# EAGLE design Mainboard (EAGLE 9.5.0)
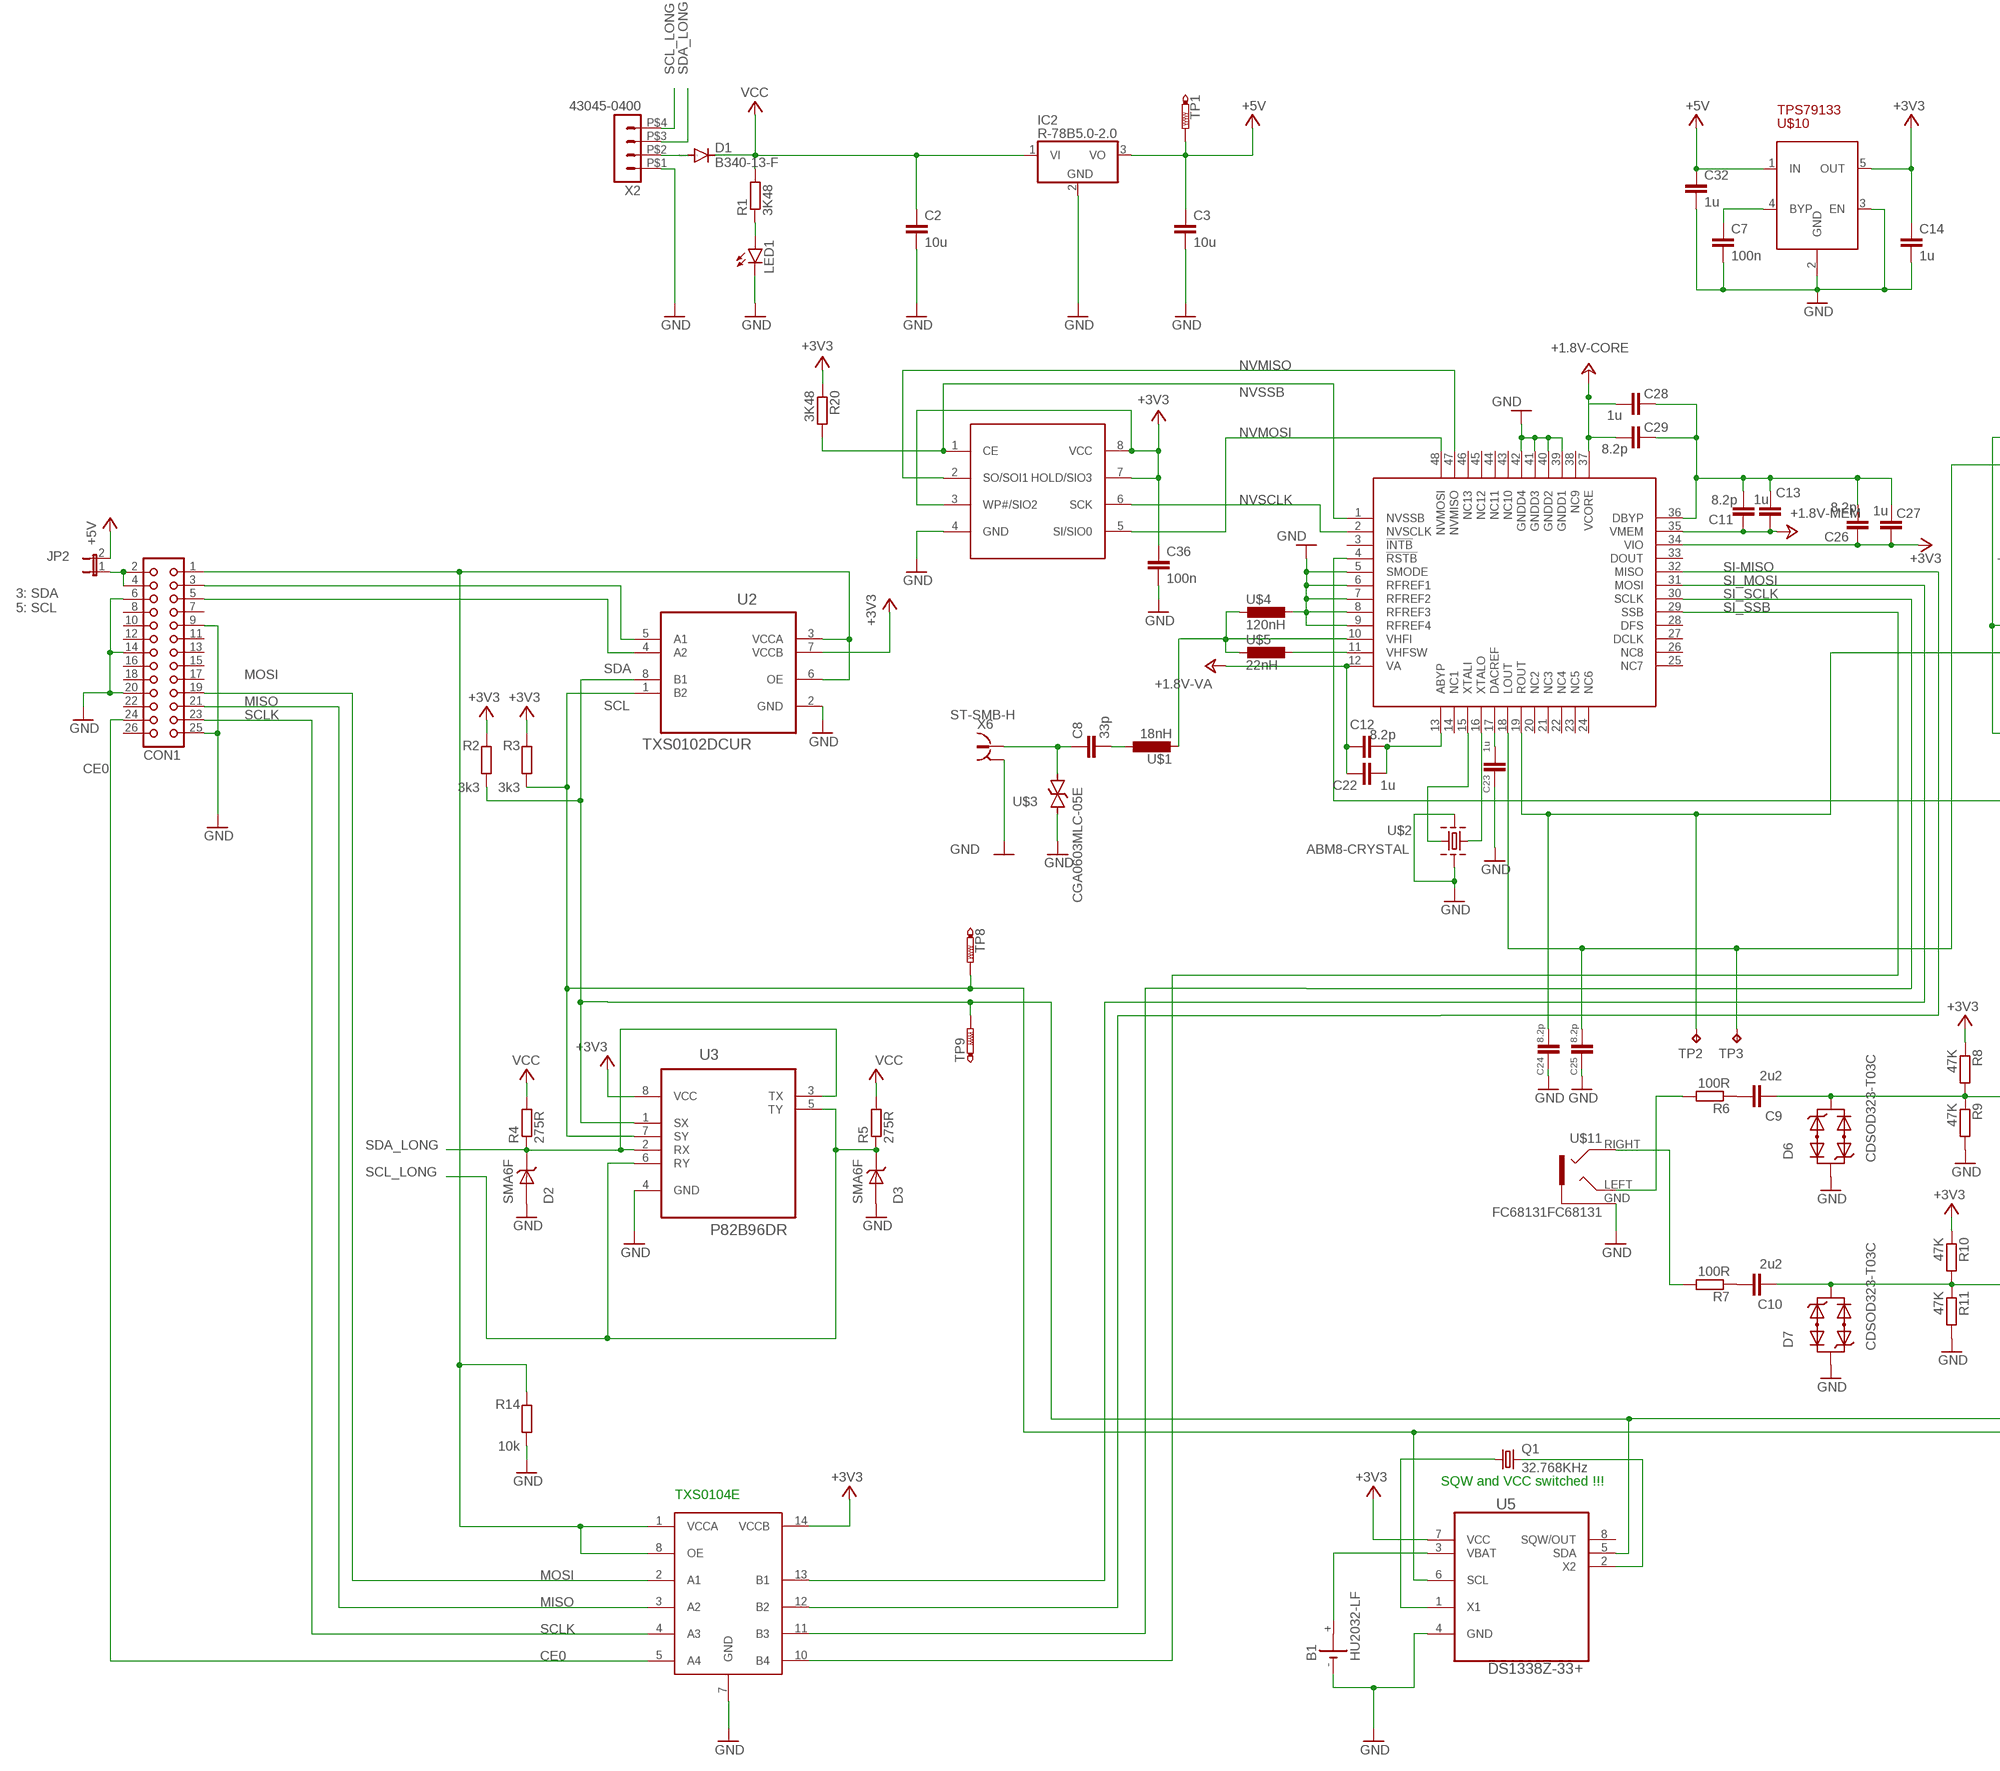
[diagram p0: schematic, sheet 1, part 1 of 3]
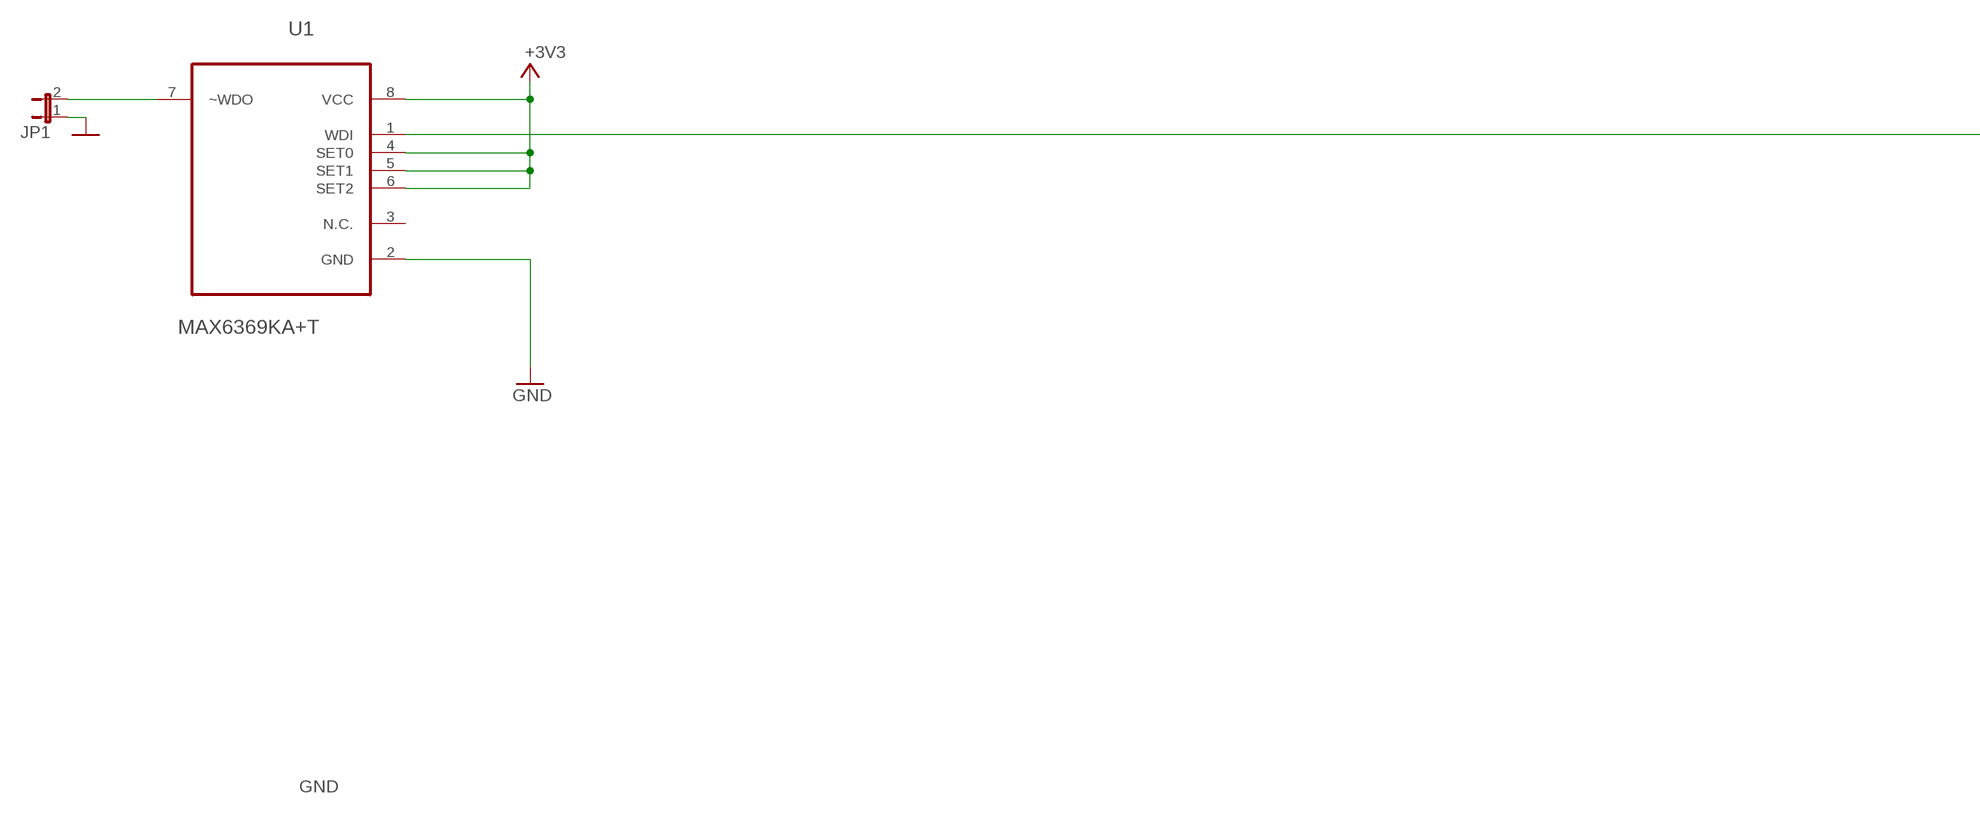
[diagram p1: schematic, sheet 1, part 2 of 3]
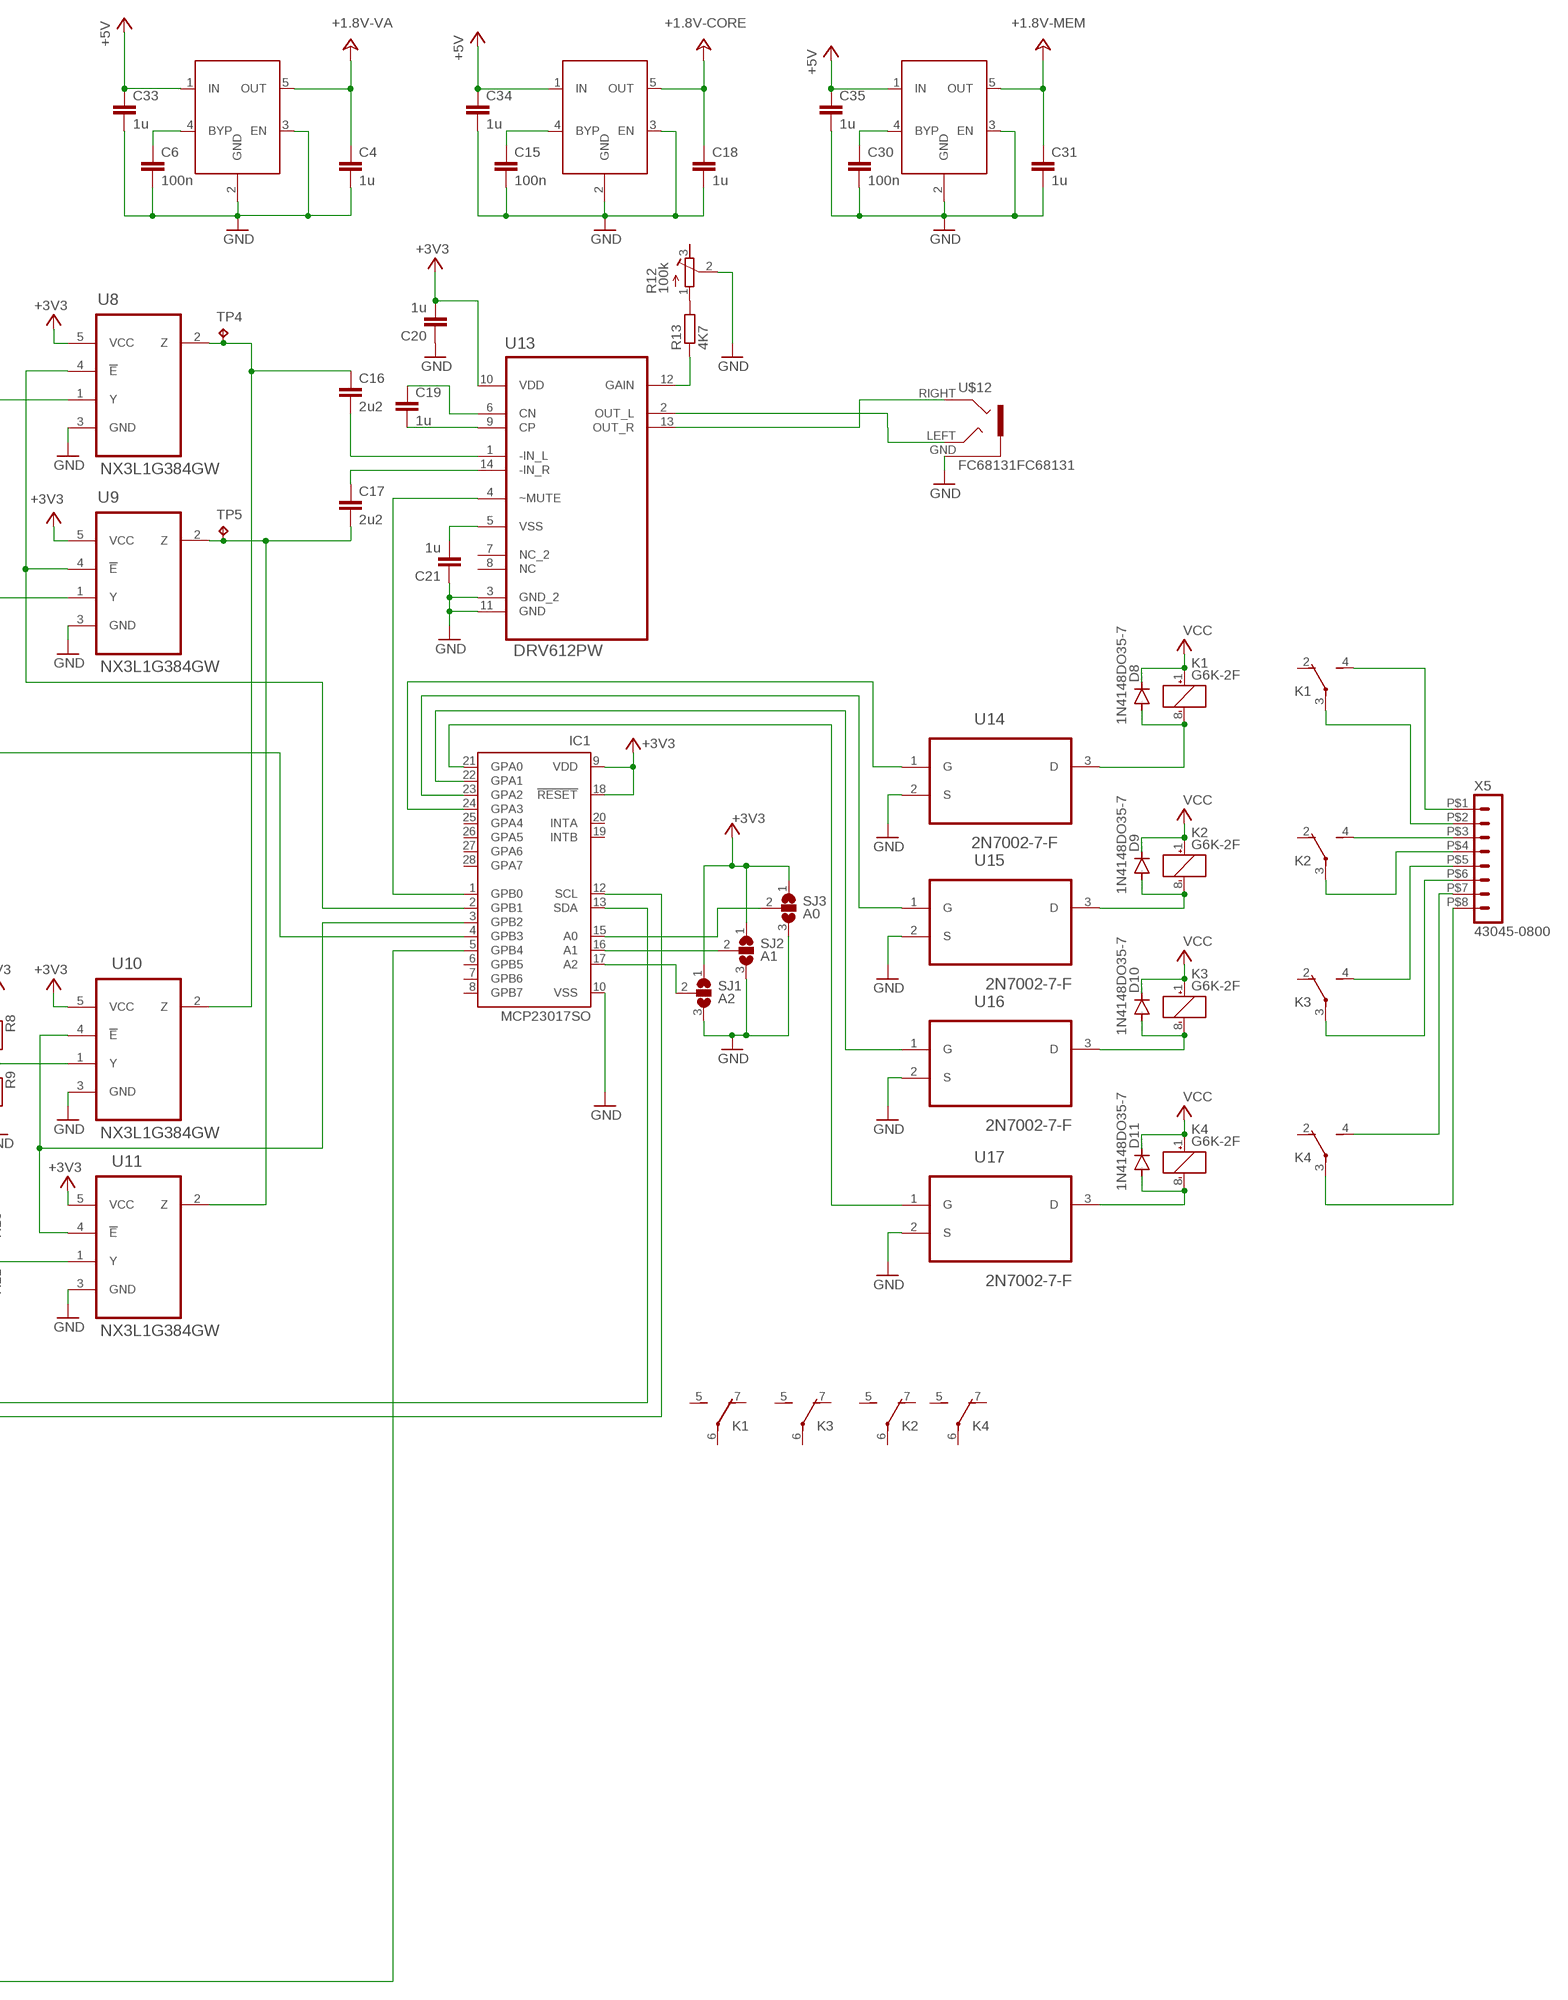
[diagram p2: schematic, sheet 1, part 3 of 3]

## Parts
B1  HU2032-LF  MYCOMPONENTS_HU2032-LF  [MYCOMPONENTS_HU2032-LF]
C2  10u  RCL_C-EUC1206  [RCL_C1206]
C3  10u  RCL_C-EUC1206  [RCL_C1206]
C4  1u  RCL_C-EUC0805  [RCL_C0805]
C6  100n  RCL_C-EUC0805  [RCL_C0805]
C7  100n  RCL_C-EUC0805  [RCL_C0805]
C8  33p  RCL_C-EUC0805  [RCL_C0805]
C9  2u2  RCL_C-EUC0805  [RCL_C0805]
C10  2u2  RCL_C-EUC0805  [RCL_C0805]
C11  8.2p  RCL_C-EUC0805  [RCL_C0805]
C12  8.2p  RCL_C-EUC0805  [RCL_C0805]
C13  1u  RCL_C-EUC0805  [RCL_C0805]
C14  1u  RCL_C-EUC0805  [RCL_C0805]
C15  100n  RCL_C-EUC0805  [RCL_C0805]
C16  2u2  RCL_C-EUC0805  [RCL_C0805]
C17  2u2  RCL_C-EUC0805  [RCL_C0805]
C18  1u  RCL_C-EUC0805  [RCL_C0805]
C19  1u  RCL_C-EUC1005  [RCL_C1005]
C20  1u  RCL_C-EUC1005  [RCL_C1005]
C21  1u  RCL_C-EUC1005  [RCL_C1005]
C22  1u  RCL_C-EUC0805  [RCL_C0805]
C23  1u  RCL_C-EUC0805  [RCL_C0805]
C24  8.2p  RCL_C-EUC0805  [RCL_C0805]
C25  8.2p  RCL_C-EUC0805  [RCL_C0805]
C26  8.2p  RCL_C-EUC0805  [RCL_C0805]
C27  1u  RCL_C-EUC0805  [RCL_C0805]
C28  1u  RCL_C-EUC0805  [RCL_C0805]
C29  8.2p  RCL_C-EUC0805  [RCL_C0805]
C30  100n  RCL_C-EUC0805  [RCL_C0805]
C31  1u  RCL_C-EUC0805  [RCL_C0805]
C32  1u  RCL_C-EUC0805  [RCL_C0805]
C33  1u  RCL_C-EUC0805  [RCL_C0805]
C34  1u  RCL_C-EUC0805  [RCL_C0805]
C35  1u  RCL_C-EUC0805  [RCL_C0805]
C36  100n  RCL_C-EUC0805  [RCL_C0805]
CON1  CON26  [CON26]
D1  B340-13-F  DIODE_DIODE-DO-214AC  [DIODE_DO-214AC]
D2  SMA6F  MYCOMPONENTS_SMA6F  [MYCOMPONENTS_DO-221AC]
D3  SMA6F  MYCOMPONENTS_SMA6F  [MYCOMPONENTS_DO-221AC]
D6  CDSOD323-T03C  MYCOMPONENTS_CDSOD323-T03C  [MYCOMPONENTS_SOD323]
D7  CDSOD323-T03C  MYCOMPONENTS_CDSOD323-T03C  [MYCOMPONENTS_SOD323]
D8  1N4148DO35-7  DIODE_1N4148DO35-7  [DIODE_DO35-7]
D9  1N4148DO35-7  DIODE_1N4148DO35-7  [DIODE_DO35-7]
D10  1N4148DO35-7  DIODE_1N4148DO35-7  [DIODE_DO35-7]
D11  1N4148DO35-7  DIODE_1N4148DO35-7  [DIODE_DO35-7]
IC1  MCP23017SO  MICROCHIP_MCP23017SO  [MICROCHIP_SO28W]
IC2  R-78B5.0-2.0  7805TV  [TO220V]
JP1  JUMPER_JP1E  [JUMPER_JP1]
JP2  JUMPER_JP1E  [JUMPER_JP1]
K1  G6K-2F  RELAY_G6K-2F  [RELAY_G6K-2F]
K2  G6K-2F  RELAY_G6K-2F  [RELAY_G6K-2F]
K3  G6K-2F  RELAY_G6K-2F  [RELAY_G6K-2F]
K4  G6K-2F  RELAY_G6K-2F  [RELAY_G6K-2F]
LED1  LEDCHIP-LED0805  [CHIP-LED0805]
Q1  32.768KHz  CRYSTAL_CRYSTALTC26V  [CRYSTAL_TC26V]
R1  3K48  R-EU_M0805  [M0805]
R2  3k3  R-EU_M0805  [M0805]
R3  3k3  R-EU_M0805  [M0805]
R4  275R  R-EU_M0805  [M0805]
R5  275R  R-EU_M0805  [M0805]
R6  100R  R-EU_M0805  [M0805]
R7  100R  R-EU_M0805  [M0805]
R8  47K  R-EU_M0805  [M0805]
R9  47K  R-EU_M0805  [M0805]
R10  47K  R-EU_M0805  [M0805]
R11  47K  R-EU_M0805  [M0805]
R12  100k  RESISTOR_R-TRIMM4G/J  [RESISTOR_RTRIM4G/J]
R13  4K7  R-EU_M0805  [M0805]
R14  10k  R-EU_M0805  [M0805]
R20  3K48  R-EU_M0805  [M0805]
SJ1  A2  SJ2W  [SJ_2]
SJ2  A1  SJ2W  [SJ_2]
SJ3  A0  SJ2W  [SJ_2]
SPI  TXS0104E  [TEXAS_SOP65P640X120-14N]
TP1  PTR1PAD1-13  [P1-13]
TP2  TESTPAD_TPTP07SQ  [TESTPAD_TP07SQ]
TP3  TESTPAD_TPTP07SQ  [TESTPAD_TP07SQ]
TP4  TESTPAD_TPTP07SQ  [TESTPAD_TP07SQ]
TP5  TESTPAD_TPTP07SQ  [TESTPAD_TP07SQ]
TP8  PTR1PAD1-13  [P1-13]
TP9  PTR1PAD1-13  [P1-13]
U1  MAX6369KA+T  MAXIM_BY_ELEMENT14_BATCH_1_MAX6369KA+T  [MAXIM_BY_ELEMENT14_BATCH_1_SOT65P280X145-8N]
U2  TXS0102DCUR  TEXAS_TXS0102DCUR  [TEXAS_SOP50P310X90-8N]
U3  P82B96DR  TEXAS_P82B96DR  [TEXAS_SOIC127P600X175-8N]
U5  DS1338Z-33+  MAXIM_BY_ELEMENT14_BATCH_1_DS1338Z-33+  [MAXIM_BY_ELEMENT14_BATCH_1_SOIC127P600X175-8N]
U8  NX3L1G384GW  NXP_BY_ELEMENT14_BATCH_1_NX3L1G384GW  [NXP_BY_ELEMENT14_BATCH_1_SOT65P212X110-5N]
U9  NX3L1G384GW  NXP_BY_ELEMENT14_BATCH_1_NX3L1G384GW  [NXP_BY_ELEMENT14_BATCH_1_SOT65P212X110-5N]
U10  NX3L1G384GW  NXP_BY_ELEMENT14_BATCH_1_NX3L1G384GW  [NXP_BY_ELEMENT14_BATCH_1_SOT65P212X110-5N]
U11  NX3L1G384GW  NXP_BY_ELEMENT14_BATCH_1_NX3L1G384GW  [NXP_BY_ELEMENT14_BATCH_1_SOT65P212X110-5N]
U13  DRV612PW  TEXAS_DRV612PW  [TEXAS_SOP65P640X120-14N]
U14  2N7002-7-F  DIODES_2N7002-7-F  [DIODES_SOT103P240X110-3N]
U15  2N7002-7-F  DIODES_2N7002-7-F  [DIODES_SOT103P240X110-3N]
U16  2N7002-7-F  DIODES_2N7002-7-F  [DIODES_SOT103P240X110-3N]
U17  2N7002-7-F  DIODES_2N7002-7-F  [DIODES_SOT103P240X110-3N]
U$1  18nH  MAINBOARD_L-0603  [MAINBOARD_0603]
U$2  ABM8-CRYSTAL  [ABM8]
U$3  CGA0603MLC-05E  MAINBOARD_CGA0603MLC-05E  [MAINBOARD_C0603K]
U$4  120nH  MAINBOARD_L-0603  [MAINBOARD_0603]
U$5  22nH  MAINBOARD_L-0603  [MAINBOARD_0603]
U$6  SI4684-MYSMD  [QFN48-SI4684]
U$7  TPS79118  [SOT23-5]
U$8  TPS79118  [SOT23-5]
U$9  TPS79118  [SOT23-5]
U$10  TPS79133  [SOT23-5]
U$11  FC68131FC68131  [FC68131]
U$12  FC68131FC68131  [FC68131]
U$13  SST26VF032B  [SOIJ8]
X2  43045-0400  CON-MOLEX-MICRO-FIT-3_0_HEADER_POS4_43045-0401  [CON-MOLEX-MICRO-FIT-3_0_43045-0400]
X5  43045-0800  CON-MOLEX-MICRO-FIT-3_0_HEADER_POS8_43045-0800  [CON-MOLEX-MICRO-FIT-3_0_43045-0800]
X6  ST-SMB-H  MAINBOARD_ST-SMB-H  [MAINBOARD_ST-SMB-H]

## Nets
+1.8-MEM: C11.1 C13.1 C31.1 U$6.35(VMEM) U$9.5(OUT) ; supply symbol labelled +1.8V-MEM
+1.8-VA: C4.1 C12.1 C22.1 U$6.12(VA) U$7.5(OUT) ; supply symbol labelled +1.8V-VA
+1.8-VCORE: C18.1 C28.2 C29.2 U$6.37(VCORE) U$8.5(OUT) ; supply symbol labelled +1.8V-CORE
+3V3 [DABChip]: C14.1 C20.2 C26.1 C27.1 C36.1 IC1.9(VDD) IC1.18(!RESET) R2.2 R3.2 R8.1 R10.1 R20.1 SJ1.1 SJ2.1 SJ3.1 SPI.14(VCCB) U1.4(SET0) U1.5(SET1) U1.6(SET2) U1.8(VCC) U2.7(VCCB) U3.8(VCC) U5.7(VCC) U8.5(VCC) U9.5(VCC) U10.5(VCC) U11.5(VCC) U13.10(VDD) U$6.34(VIO) U$10.5(OUT) U$13.3(WP#/SIO2) U$13.7(HOLD/SIO3) U$13.8(VCC)
+5V [Big Vcc]: C3.1 C32.1 C33.1 C34.1 C35.1 IC2.3(VO) JP2.2 TP1.TP U$7.1(IN) U$8.1(IN) U$9.1(IN) U$10.1(IN)
CE0: CON1.24 SPI.5(A4)
GND [DABChip]: B1.- C2.2 C3.2 C4.2 C6.2 C7.2 C14.2 C15.2 C18.2 C20.1 C21.1 C23.1 C24.1 C25.1 C30.2 C31.2 C32.2 C33.2 C34.2 C35.2 C36.2 CON1.6 CON1.9 CON1.14 CON1.20 CON1.25 D2.AN D3.AN D6.P$1 D7.P$1 IC1.10(VSS) IC2.2(GND) JP1.1 LED1.C R9.2 R11.2 R12.2(S) R14.1 SJ1.3 SJ2.3 SJ3.3 SPI.7(GND) U1.2(GND) U2.2(GND) U3.4(GND) U5.4(GND) U8.3(GND) U9.3(GND) U10.3(GND) U11.3(GND) U13.3(GND_2) U13.11(GND) U14.2(S) U15.2(S) U16.2(S) U17.2(S) U$2.1(GND1) U$2.3(GND2) U$3.1 U$4.1 U$6.5(SMODE) U$6.6(RFREF1) U$6.7(RFREF2) U$6.8(RFREF3) U$6.9(RFREF4) U$6.39(GNDD1) U$6.40(GNDD2) U$6.41(GNDD3) U$6.42(GNDD4) U$7.2(GND) U$7.3(EN) U$8.2(GND) U$8.3(EN) U$9.2(GND) U$9.3(EN) U$10.2(GND) U$10.3(EN) U$11.GND U$12.GND U$13.4(GND) X2.P$1 X6.2 X6.3 X6.4 X6.5
MISO: CON1.21 SPI.3(A2)
MOSI: CON1.19 SPI.2(A1)
N$1: D1.A X2.P$2
N$2: U$2.2 U$6.15(XTALI)
N$3: CON1.3 U2.5(A1)
N$4 [Big Vcc]: CON1.2 CON1.4 JP2.1
N$5: K1.4(2:S) X5.P$1
N$6: CON1.5 U2.4(A2)
N$7: IC1.21(GPA0) U17.1(G)
N$8: CON1.1 R14.2 SPI.1(VCCA) SPI.8(OE) U2.3(VCCA) U2.6(OE)
N$9: D11.A K4.8(1:-) U17.3(D)
N$10: IC1.17(A2) SJ1.2
N$11: IC1.16(A1) SJ2.2
N$12: K4.4(2:S) X5.P$7
N$13: K4.3(2:P) X5.P$8
N$14: LED1.A R1.1
N$15: Q1.2 U5.2(X2)
N$16: B1.+ U5.3(VBAT)
N$17: Q1.1 U5.1(X1)
N$18: IC1.24(GPA3) U14.1(G)
N$19: IC1.23(GPA2) U15.1(G)
N$20: K1.3(2:P) X5.P$2
N$21: IC1.22(GPA1) U16.1(G)
N$22: D8.A K1.8(1:-) U14.3(D)
N$23: D9.A K2.8(1:-) U15.3(D)
N$24: D10.A K3.8(1:-) U16.3(D)
N$26 [DABChip]: U$2.4 U$6.16(XTALO)
N$27 [DABChip]: C25.2 TP3.TP U8.1(Y) U$6.18(LOUT)
N$28: C8.1 U$3.2 X6.1
N$29: C16.1 TP4.TP U8.2(Z) U10.2(Z)
N$30: C17.2 TP5.TP U9.2(Z) U11.2(Z)
N$31: IC1.3(GPB2) U10.4(!E) U11.4(!E)
N$32: U$5.1 U$6.11(VHFSW)
N$33: IC1.5(GPB4) U1.1(WDI)
N$34 [DABChip]: C24.2 TP2.TP U9.1(Y) U$6.19(ROUT)
N$35 [DABChip]: IC1.4(GPB3) U$6.4(!RSTB)
N$36: C10.2 D7.P$2 R10.2 R11.1 U11.1(Y)
N$37: C9.2 D6.P$2 R8.2 R9.1 U10.1(Y)
N$38: IC1.1(GPB0) U13.4(~MUTE)
N$39: C6.1 U$7.4(BYP)
N$40: U13.2(OUT_L) U$12.LEFT
N$41: IC1.15(A0) SJ3.2
N$44: U13.13(OUT_R) U$12.RIGHT
N$45: R12.1(E) R13.2
N$46: R13.1 U13.12(GAIN)
N$47: R6.2 U$11.LEFT
N$48: C9.1 R6.1
N$49: R7.2 U$11.RIGHT
N$50: C10.1 R7.1
N$51: JP1.2 U1.7(~WDO)
N$52: K2.4(2:S) X5.P$3
N$53: C16.2 U13.1(-IN_L)
N$54: C19.2 U13.9(CP)
N$55: C17.1 U13.14(-IN_R)
N$56: C19.1 U13.6(CN)
N$57: C21.2 U13.5(VSS)
N$58: C15.1 U$8.4(BYP)
N$59: U$1.2 U$4.2 U$5.2 U$6.10(VHFI)
N$60: K2.3(2:P) X5.P$4
N$61: C8.2 U$1.1
N$62: C30.1 U$9.4(BYP)
N$63: K3.4(2:S) X5.P$5
N$64: K3.3(2:P) X5.P$6
N$65: C7.1 U$10.4(BYP)
N$66: IC1.2(GPB1) U8.4(!E) U9.4(!E)
N$68 [DABChip]: C12.2 C22.2 U$6.13(ABYP)
N$69 [DABChip]: C23.2 U$6.17(DACREF)
N$70 [DABChip]: C11.2 C13.2 C26.2 C27.2 C28.1 C29.1 U$6.36(DBYP)
NVMISO: U$6.47(NVMISO) U$13.2(SO/SOI1)
NVMOSI: U$6.48(NVMOSI) U$13.5(SI/SIO0)
NVSCLK: U$6.2(NVSCLK) U$13.6(SCK)
NVSSB: R20.2 U$6.1(NVSSB) U$13.1(CE)
SCL [DABChip]: IC1.12(SCL) R3.1 TP8.TP U2.1(B2) U3.7(SY) U5.6(SCL)
SCL_LONG: D3.KAT R5.1 U3.5(TY) U3.6(RY) X2.P$4
SCLK: CON1.23 SPI.4(A3)
SDA [DABChip]: IC1.13(SDA) R2.1 TP9.TP U2.8(B1) U3.1(SX) U5.5(SDA)
SDA_LONG: D2.KAT R4.1 U3.2(RX) U3.3(TX) X2.P$3
SI-MISO [DABChip]: SPI.12(B2) U$6.32(MISO)
SI_MOSI: SPI.13(B1) U$6.31(MOSI)
SI_SCLK [DABChip]: SPI.11(B3) U$6.30(SCLK)
SI_SSB: SPI.10(B4) U$6.29(SSB)
VCC [Big Vcc]: C2.1 D1.C D8.C D9.C D10.C D11.C IC2.1(VI) K1.1(1:+) K2.1(1:+) K3.1(1:+) K4.1(1:+) R1.2 R4.2 R5.2
Unconnected: B1.+@1(+) CON1.7 CON1.8 CON1.10 CON1.11 CON1.12 CON1.13 CON1.15 CON1.16 CON1.17 CON1.18 CON1.22 CON1.26 IC1.6(GPB5) IC1.7(GPB6) IC1.8(GPB7) IC1.19(INTB) IC1.20(INTA) IC1.25(GPA4) IC1.26(GPA5) IC1.27(GPA6) IC1.28(GPA7) K1.2(2:O) K1.5(3:S) K1.6(3:P) K1.7(3:O) K2.2(2:O) K2.5(3:S) K2.6(3:P) K2.7(3:O) K3.2(2:O) K3.5(3:S) K3.6(3:P) K3.7(3:O) K4.2(2:O) K4.5(3:S) K4.6(3:P) K4.7(3:O) R12.3(A) U1.3(N.C.) U5.8(SQW/OUT) U13.7(NC_2) U13.8(NC) U$6.3(!INTB) U$6.14(NC1) U$6.20(NC2) U$6.21(NC3) U$6.22(NC4) U$6.23(NC5) U$6.24(NC6) U$6.25(NC7) U$6.26(NC8) U$6.27(DCLK) U$6.28(DFS) U$6.33(DOUT) U$6.38(NC9) U$6.43(NC10) U$6.44(NC11) U$6.45(NC12) U$6.46(NC13)

## Notes on the sheet
- 3: SDA
  5: SCL
- SDA
- SCL
- SQW and VCC switched !!!
- TXS0104E

## Library data of the parts
B1 = Mainboard:MYCOMPONENTS_HU2032-LF
C2-C4 C6-C36 = Mainboard:RCL_C-EU: CAPACITOR, European symbol
CON1 = con-harting:CON26: CONNECTOR; OC_FARNELL: unknown; OC_NEWARK: unknown
D1 = Mainboard:DIODE_DIODE-: DIODE
D2 D3 = Mainboard:MYCOMPONENTS_SMA6F
D6 D7 = Mainboard:MYCOMPONENTS_CDSOD323-T03C
D8-D11 = Mainboard:DIODE_1N4148: DIODE high speed (Philips)
IC1 = Mainboard:MICROCHIP_MCP23017: http://ww1.microchip.com/downloads/en/DeviceDoc/21952a.pdf Source: http://ww1.microchip.com/downloads/en/DeviceDoc/21952a.pdf; MF: MICROCHIP; MPN: MCP23017-E/SO; OC_FARNELL: 1332087; OC_NEWARK: 31K2958
IC2 = linear:78*: Positive VOLTAGE REGULATOR Source: http://cache.national.com/ds/LM/LM78L05.pdf http://www.fairchildsemi.com/ds/LM/LM7805.pdf
JP1 JP2 = Mainboard:JUMPER_JP1E: JUMPER
K1-K4 = Mainboard:RELAY_G6K: Low Signal Relay oeiwcsnts1.omron.com/.. D20G6K0100.pdf; MF: OMRON COMPONENTS USA; MPN: G6K-2F DC24; OC_FARNELL: 1690427; OC_NEWARK: 36K7467
LED1 = led:LED: LED OSRAM: - CHIPLED LG R971, LG N971, LY N971, LG Q971, LY Q971, LO R971, LY R971 LH N974, LH R974 LS Q976, LO Q976, LY Q976 LO Q996 - Hyper CHIPLED LW Q18S LB Q993, LB Q99A, LB R99A - SideLED LS A670, LO A670, LY A670, LG A670, LP A670 LB A673, LV A673, LT A673, LW A673 LH A674 LY A675 LS A676, LA A676, LO A676, LY A676, LW A676 LS A679, LY A679, LG A679 - Hyper Micro SIDELED® LS Y876, LA Y876, LO Y876, LY Y876 LT Y87S - SmartLED LW L88C, LW L88S LB L89C, LB L89S, LG L890 LS L89K, LO L89K, LY L89K LS L896, LA L896, LO L896, LY L896 - TOPLED LS T670, LO T670, LY T670, LG T670, LP T670 LSG T670, LSP T670, LSY T670, LOP T670, LYG T670 LG T671, LOG T671, LSG T671 LB T673, LV T673, LT T673, LW T673 LH T674 LS T676, LA T676, LO T676, LY T676, LB T676, LH T676, LSB T676, LW T676 LB T67C, LV T67C, LT T67C, LS T67K, LO T67K, LY T67K, LW E67C LS E67B, LA E67B, LO E67B, LY E67B, LB E67C, LV E67C, LT E67C LW T67C LS T679, LY T679, LG T679 LS T770, LO T770, LY T770, LG T770, LP T770 LB T773, LV T773, LT T773, LW T773 LH T774 LS E675, LA E675, LY E675, LS T675 LS T776, LA T776, LO T776, LY T776, LB T776 LHGB T686 LT T68C, LB T68C - Hyper Mini TOPLED® LB M676 - Mini TOPLED Santana® LG M470 LS M47K, LO M47K, LY M47K Source: http://www.osram.convergy.de LUXEON: - LUMILED® LXK2-PW12-R00, LXK2-PW12-S00, LXK2-PW14-U00, LXK2-PW14-V00 LXK2-PM12-R00, LXK2-PM12-S00, LXK2-PM14-U00 LXK2-PE12-Q00, LXK2-PE12-R00, LXK2-PE12-S00, LXK2-PE14-T00, LXK2-PE14-U00 LXK2-PB12-K00, LXK2-PB12-L00, LXK2-PB12-M00, LXK2-PB14-N00, LXK2-PB14-P00, LXK2-PB14-Q00 LXK2-PR12-L00, LXK2-PR12-M00, LXK2-PR14-Q00, LXK2-PR14-R00 LXK2-PD12-Q00, LXK2-PD12-R00, LXK2-PD12-S00 LXK2-PH12-R00, LXK2-PH12-S00 LXK2-PL12-P00, LXK2-PL12-Q00, LXK2-PL12-R00 Source: www.luxeon.com KINGBRIGHT: KA-3528ASYC Source: www.kingbright.com
Q1 = Mainboard:CRYSTAL_CRYSTAL: CRYSTAL; OC_FARNELL: unknown; OC_NEWARK: unknown
R1-R11 R13 R14 R20 = rcl:R-EU_: RESISTOR, European symbol; SPICEPREFIX: R
R12 = Mainboard:RESISTOR_R-TRIMM: Trimm resistor
SJ1-SJ3 = jumper:SJ2W: SMD solder JUMPER
SPI = Mainboard:TXS0104E
TP1 TP8 TP9 = testpad:PTR1: TEST PIN
TP2-TP5 = Mainboard:TESTPAD_TP: Test pad
U1 = Mainboard:MAXIM_BY_ELEMENT14_BATCH_1_MAX6369KA+T: Pin-Selectable Watchdog Timers; MPN: MAX6369KA+T; OC_FARNELL: 1787051; OC_NEWARK: 68K9450; PACKAGE: SOT23-8; SUPPLIER: Maxim
U2 = Mainboard:TEXAS_TXS0102DCUR: 2-BIT BIDIRECTIONAL VOLTAGE-LEVEL TRANSLATOR FOR OPEN-DRAIN AND PUSH-PULL APPLICATIONS; MPN: TXS0102DCUR; OC_FARNELL: 1703315; OC_NEWARK: 30M1878; PACKAGE: SOP-8; SUPPLIER: Texas Instruments
U3 = Mainboard:TEXAS_P82B96DR: DUAL BIDIRECTIONAL BUS BUFFER; MPN: P82B96DR; OC_FARNELL: 1576671; OC_NEWARK: 88K6385; PACKAGE: SOIC-8; SUPPLIER: Texas Instruments
U5 = Mainboard:MAXIM_BY_ELEMENT14_BATCH_1_DS1338Z-33+: I2C RTC with 56-Byte NV RAM; MPN: DS1338Z-33+; OC_FARNELL: 1379714; OC_NEWARK: 27K7425; PACKAGE: SOIC-8; SUPPLIER: Maxim
U8-U11 = Mainboard:NXP_BY_ELEMENT14_BATCH_1_NX3L1G384GW: Low-ohmic single-pole single-throw analog switch,TSSOP-5; MPN: NX3L1G384GW; OC_FARNELL: 2164820; OC_NEWARK: 55W4258; PACKAGE: TSSOP-5(SOT); SUPPLIER: NXP
U13 = Mainboard:TEXAS_DRV612PW: Line Driver With Programmable-Fixed Gain; MPN: DRV612PW; OC_FARNELL: 1882273; OC_NEWARK: 27T6360; PACKAGE: TSSOP-14; SUPPLIER: Texas Instruments
U14-U17 = Mainboard:DIODES_2N7002-7-F: N-CHANNEL ENHANCEMENT MODE FIELD EFFECT TRANSISTOR; MPN: 2N7002-7-F; OC_FARNELL: 1713823; OC_NEWARK: 25R5679; PACKAGE: SOT-23-3; SUPPLIER: DIODES INC.
U$1 U$4 U$5 = Mainboard:MAINBOARD_L-0603
U$2 = Mainboard:ABM8-CRYSTAL
U$3 = Mainboard:MAINBOARD_CGA0603MLC-05E
U$6 = Mainboard:SI4684-MYSMD
U$7-U$9 = Mainboard:TPS79118
U$10 = Mainboard:TPS79133
U$11 U$12 = Mainboard:FC68131
U$13 = Mainboard:SST26VF032B
X2 = Mainboard:CON-MOLEX-MICRO-FIT-3_0_HEADER_POS4_?: Molex - Micro-Fit 3.0 Series connector, 3.00mm (0.118") pitch header, 4 positions.
X5 = Mainboard:CON-MOLEX-MICRO-FIT-3_0_HEADER_POS8_?: Molex - Micro-Fit 3.0 Series connector, 3.00mm (0.118") pitch header, 8 positions.
X6 = Mainboard:MAINBOARD_ST-SMB-H: MALE SMB CONNECTOR Radiall distributor Farnell 4194548; OC_FARNELL: unknown; OC_NEWARK: unknown

## Net classes
0 default: width 0.254 mm, clearance 0.203 mm
1 Normal Bcc: width 0.254 mm, clearance 0.203 mm
2 Big Vcc: width 0.762 mm, clearance 0.203 mm
3 LED Current: width 0.381 mm, clearance 0.203 mm
4 DABChip: width 0.254 mm, clearance 0.203 mm

## Board
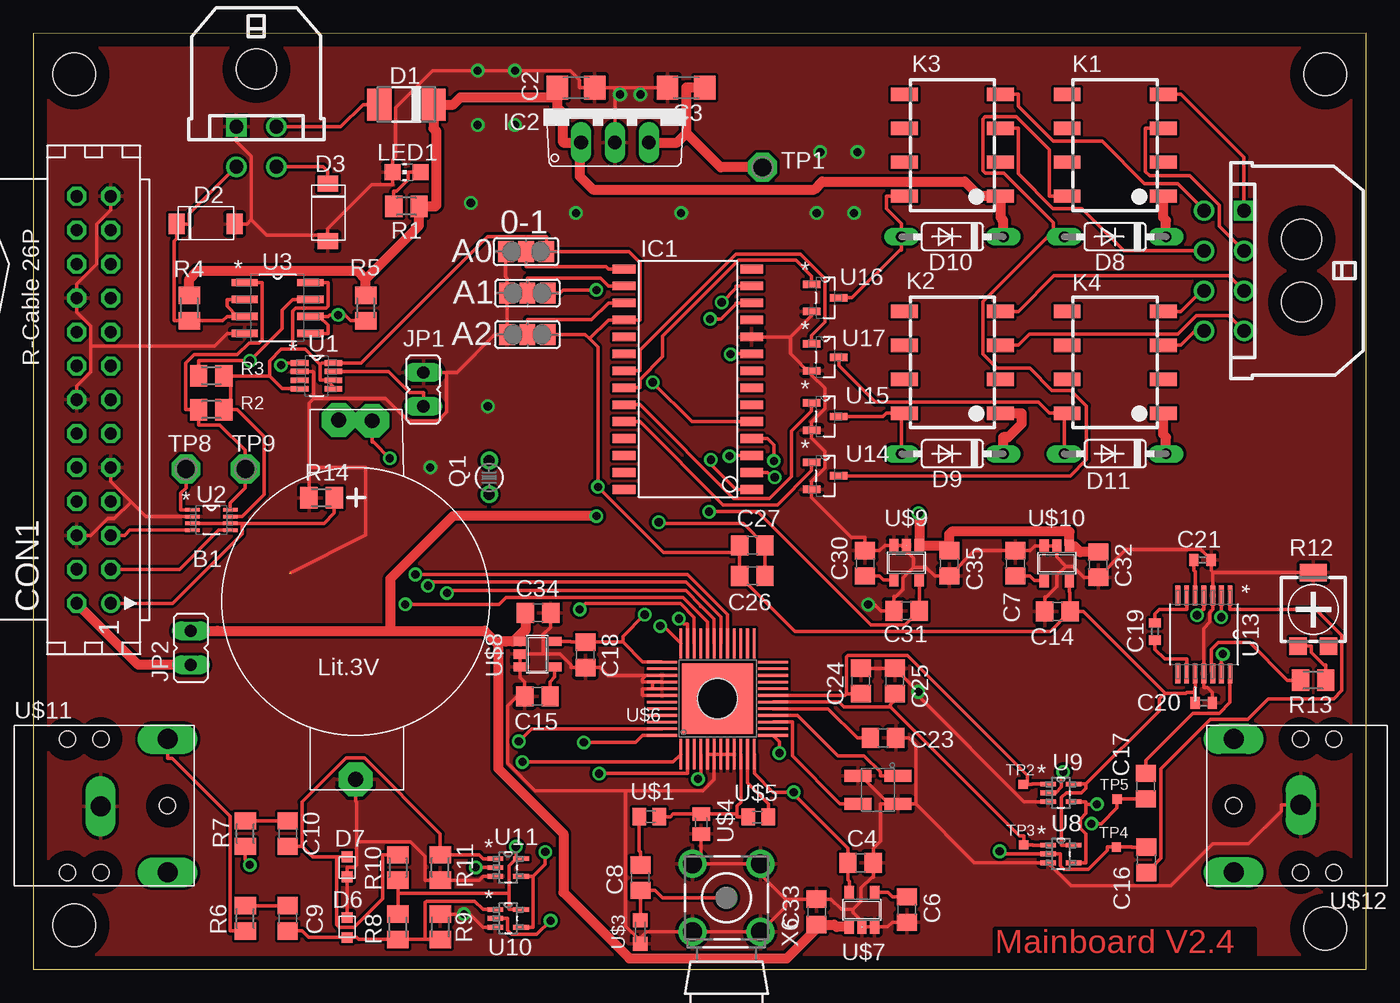
[diagram p3: board, top side]
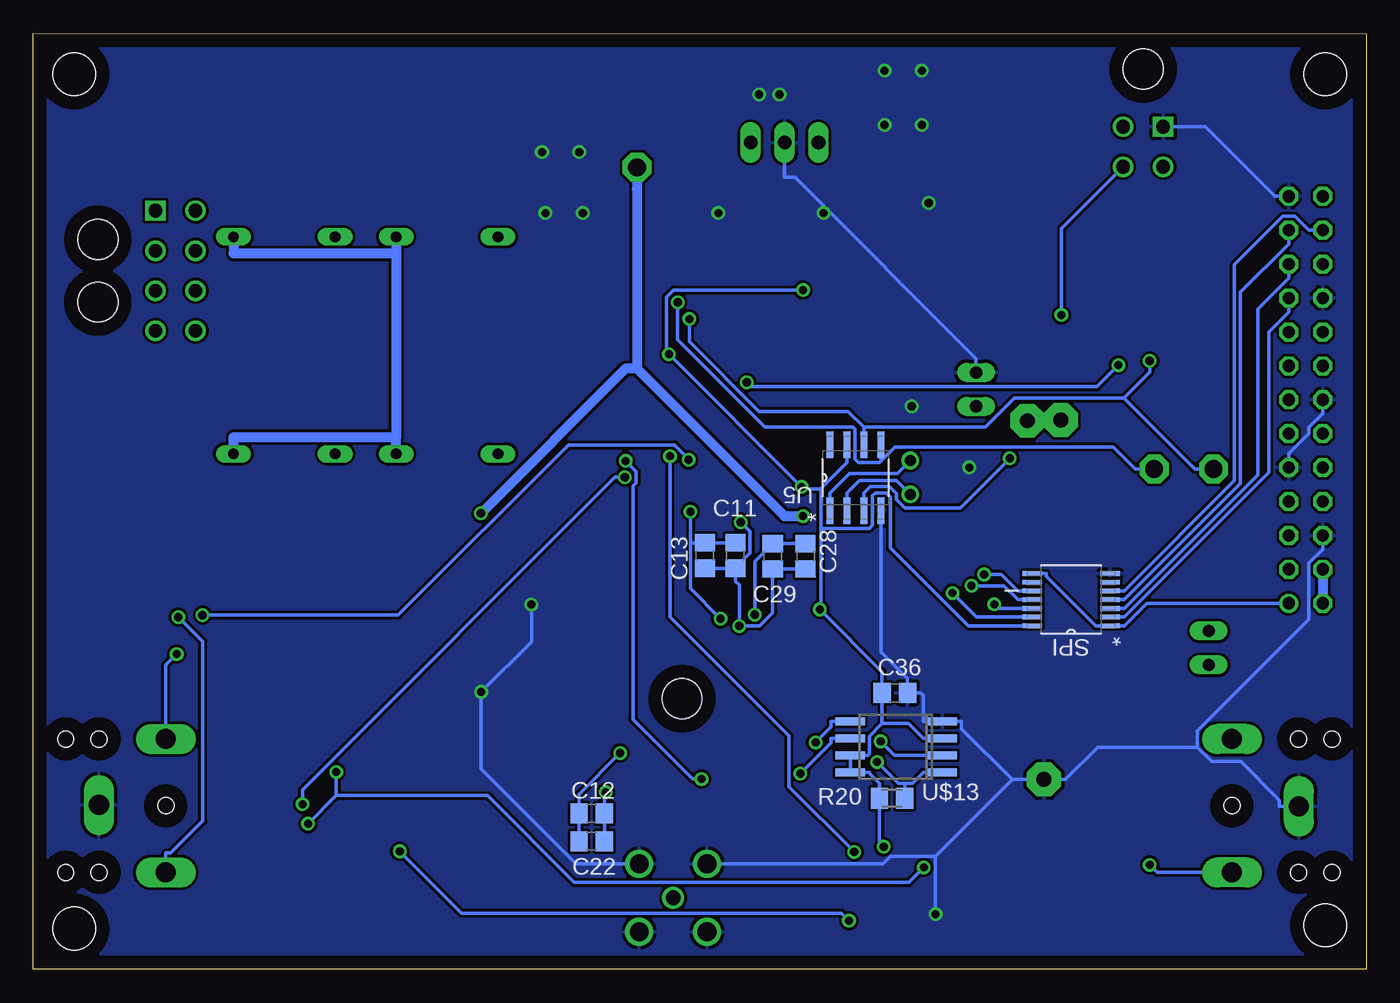
[diagram p4: board, bottom side, seen from below]

Size 99.82 x 70.1 mm. Coordinates in mm from the lower left corner, seen from the top.
Outline: 0,0 99.82,0 99.82,70.1 0,70.09 0,0
Copper layers (1*16): Top 0.035mm / dielectric 1.5mm / Bottom 0.035mm
Design rules "default *": minimum track width 10mil, minimum drill 24mil, track to track 8mil, track to pad 8mil, pad to pad 8mil, via to via 8mil, smd to smd 8mil, copper to edge 40mil, drill to drill 8mil, minimum pad ring 10mil, minimum via ring 8mil, stop-mask expansion 4mil, vias tented up to drill 0mil, thermal gap 10mil
Holes 3.2 mm at 96.77,3.05 96.77,67.06 3.05,3.3 3.05,67.06

### Footprints (pad centres in the part's own frame; a part is rotated, then mirrored left to right if it is on the bottom)
MYCOMPONENTS_HU2032-LF = drill 1.118 pad 2.54 octagon: + 1.25,13.145; +@1 -1.27,13.185; - 0,-13.73
RCL_C1206 = smd 1.6 x 1.8: 1 -1.4,0; 2 1.4,0
RCL_C0805 = smd 1.3 x 1.5: 1 -0.95,0; 2 0.95,0
RCL_C1005 = smd 0.7 x 0.9: 1 -0.65,0; 2 0.65,0
CON26 = drill 0.914: 1 -15.24,-1.27 | drill 0.914 octagon: 2 -15.24,1.27; 3 -12.7,-1.27; 4 -12.7,1.27; 5 -10.16,-1.27; 6 -10.16,1.27; 7 -7.62,-1.27; 8 -7.62,1.27; 9 -5.08,-1.27; 10 -5.08,1.27; 11 -2.54,-1.27; 12 -2.54,1.27; 13 0,-1.27; 14 0,1.27; 15 2.54,-1.27; 16 2.54,1.27; 17 5.08,-1.27; 18 5.08,1.27; 19 7.62,-1.27; 20 7.62,1.27; 21 10.16,-1.27; 22 10.16,1.27; 23 12.7,-1.27; 24 12.7,1.27; 25 15.24,-1.27; 26 15.24,1.27
DIODE_DO-214AC = smd 1.8 x 2.4: A 2.025,0; C -2.025,0
MYCOMPONENTS_DO-221AC = smd 1.2 x 1.52: AN 2.11,-0.05; KAT -2.21,-0.05
MYCOMPONENTS_SOD323 = smd 0.8 x 0.8: P$1 0.7,0; P$2 -0.8,0
DIODE_DO35-7 = drill 0.813 long: A 3.81,0; C -3.81,0
MICROCHIP_SO28W = smd 0.65 x 1.7: 1 -7.62,-4.78; 2 -6.35,-4.78; 3 -5.08,-4.78; 4 -3.81,-4.78; 5 -2.54,-4.78; 6 -1.27,-4.78; 7 0,-4.78; 8 1.27,-4.78; 9 2.54,-4.78; 10 3.81,-4.78; 11 5.08,-4.78; 12 6.35,-4.78; 13 7.62,-4.78; 14 8.89,-4.78; 15 8.89,4.78; 16 7.62,4.78; 17 6.35,4.78; 18 5.08,4.78; 19 3.81,4.78; 20 2.54,4.78; 21 1.27,4.78; 22 0,4.78; 23 -1.27,4.78; 24 -2.54,4.78; 25 -3.81,4.78; 26 -5.08,4.78; 27 -6.35,4.78; 28 -7.62,4.78
TO220V = drill 1.016 long: 1 -2.54,-2.54; 2 0,-2.54; 3 2.54,-2.54
JUMPER_JP1 = drill 0.914 long: 1 0,-1.27; 2 0,1.27
RELAY_G6K-2F = smd 1 x 2: 1 -3.81,-3.6; 2 -1.27,-3.6; 3 1.27,-3.6; 4 3.81,-3.6; 5 3.81,3.6; 6 1.27,3.6; 7 -1.27,3.6; 8 -3.81,3.6
CHIP-LED0805 = smd 1.2 x 1.2: A 0,-1.05; C 0,1.05
CRYSTAL_TC26V = drill 0.813: 1 -1.27,0; 2 1.27,0
M0805 = smd 1.3 x 1.6: 1 -0.95,0; 2 0.95,0
RESISTOR_RTRIM4G/J = smd 1.3 x 1.3: 1 -1.15,-2.75; 3 1.15,-2.75 | smd 2 x 1.3: 2 0,2.75
SJ_2 = smd 1.168 x 1.6: 1 -1.524,0; 2 0,0; 3 1.524,0
TEXAS_SOP65P640X120-14N = smd 1.473 x 0.356: 1 -2.921,1.956; 2 -2.921,1.295; 3 -2.921,0.66; 4 -2.921,0; 5 -2.921,-0.66; 6 -2.921,-1.295; 7 -2.921,-1.956; 8 2.921,-1.956; 9 2.921,-1.295; 10 2.921,-0.66; 11 2.921,0; 12 2.921,0.66; 13 2.921,1.295; 14 2.921,1.956
P1-13 = drill 1.321 pad 2.159 octagon: TP 0,0
TESTPAD_TP07SQ = smd 0.7 x 0.7: TP 0,0
MAXIM_BY_ELEMENT14_BATCH_1_SOT65P280X145-8N = smd 1.321 x 0.432: 1 -1.27,0.965; 2 -1.27,0.33; 3 -1.27,-0.33; 4 -1.27,-0.965; 5 1.27,-0.965; 6 1.27,-0.33; 7 1.27,0.33; 8 1.27,0.965
TEXAS_SOP50P310X90-8N = smd 1.067 x 0.254: 1 -1.422,0.762; 2 -1.422,0.254; 3 -1.422,-0.254; 4 -1.422,-0.762; 5 1.422,-0.762; 6 1.422,-0.254; 7 1.422,0.254; 8 1.422,0.762
TEXAS_SOIC127P600X175-8N = smd 1.981 x 0.559: 1 -2.464,1.905; 2 -2.464,0.635; 3 -2.464,-0.635; 4 -2.464,-1.905; 5 2.464,-1.905; 6 2.464,-0.635; 7 2.464,0.635; 8 2.464,1.905
MAXIM_BY_ELEMENT14_BATCH_1_SOIC127P600X175-8N = smd 1.981 x 0.533: 1 -2.464,1.905; 2 -2.464,0.635; 3 -2.464,-0.635; 4 -2.464,-1.905; 5 2.464,-1.905; 6 2.464,-0.635; 7 2.464,0.635; 8 2.464,1.905
NXP_BY_ELEMENT14_BATCH_1_SOT65P212X110-5N = smd 1.168 x 0.356: 1 -0.965,0.66; 2 -0.965,0; 3 -0.965,-0.66; 4 0.965,-0.66; 5 0.965,0.66
DIODES_SOT103P240X110-3N = smd 1.321 x 0.559: 1 -1.016,1.016; 2 -1.016,-1.016; 3 1.016,0
MAINBOARD_0603 = smd 1 x 1.3: 1 -0.85,0; 2 0.65,0
ABM8 = smd 0.9 x 2: 1 -1.65,-1.5; 2 0.45,-1.5; 3 0.45,1.5; 4 -1.65,1.5
MAINBOARD_C0603K = smd 1.05 x 1.08: 1 -0.875,0; 2 0.875,0
QFN48-SI4684 = smd 2.25 x 0.2: 1 -4.15,2.75; 2 -4.15,2.25; 3 -4.15,1.75; 4 -4.15,1.25; 5 -4.15,0.75; 6 -4.15,0.25; 7 -4.15,-0.25; 8 -4.15,-0.75; 9 -4.15,-1.25; 10 -4.15,-1.75; 11 -4.15,-2.25; 12 -4.15,-2.75; 25 4.15,-2.75; 26 4.15,-2.25; 27 4.15,-1.75; 28 4.15,-1.25; 29 4.15,-0.75; 30 4.15,-0.25; 31 4.15,0.25; 32 4.15,0.75; 33 4.15,1.25; 34 4.15,1.75; 35 4.15,2.25; 36 4.15,2.75 | smd 0.2 x 2.25: 13 -2.75,-4.15; 14 -2.25,-4.15; 15 -1.75,-4.15; 16 -1.25,-4.15; 17 -0.75,-4.15; 18 -0.25,-4.15; 19 0.25,-4.15; 20 0.75,-4.15; 21 1.25,-4.15; 22 1.75,-4.15; 23 2.25,-4.15; 24 2.75,-4.15; 37 2.75,4.15; 38 2.25,4.15; 39 1.75,4.15; 40 1.25,4.15; 41 0.75,4.15; 42 0.25,4.15; 43 -0.25,4.15; 44 -0.75,4.15; 45 -1.25,4.15; 46 -1.75,4.15; 47 -2.25,4.15; 48 -2.75,4.15 | smd 5.3 x 5.3: EXP 0,0 | hole 3: 0,0
SOT23-5 = smd 0.69 x 0.99: 1 -0.95,-1.29; 2 0,-1.29; 3 0.95,-1.29; 4 0.95,1.3; 5 -0.95,1.3
FC68131 = drill 1.5 long: GND -0.01,-0.05; LEFT 5,5; RIGHT 5,-5 | hole 1.2: 0,-5; 0,5; 5,0; -2.5,5; -2.5,-5
SOIJ8 = smd 0.6 x 2.2: 1 -1.905,-4.3; 2 -0.635,-4.3; 3 0.635,-4.3; 4 1.905,-4.3; 5 1.905,2.6; 6 0.635,2.6; 7 -0.635,2.6; 8 -1.905,2.6
CON-MOLEX-MICRO-FIT-3_0_43045-0400 = drill 1.02 square: P$1 1.5,4.32 | drill 1.02: P$2 -1.5,4.32; P$3 1.5,7.32; P$4 -1.5,7.32 | hole 3: 0,0
CON-MOLEX-MICRO-FIT-3_0_43045-0800 = drill 1.02 square: P$1 4.5,4.32 | drill 1.02: P$2 1.5,4.32; P$3 -1.5,4.32; P$4 -4.5,4.32; P$5 4.5,7.32; P$6 1.5,7.32; P$7 -1.5,7.32; P$8 -4.5,7.32 | hole 3: 2.35,0; -2.35,0
MAINBOARD_ST-SMB-H = drill 1.1: 1 0,0 | drill 1.4: 2 -2.54,2.54; 3 2.54,2.54; 4 2.54,-2.54; 5 -2.54,-2.54

### Placement (x,y rotation side)
B1  24.13,27.94 0 top
C2  40.64,66.04 0 top
C3  48.9,66.04 180 top
C4  61.96,7.97 0 top
C6  65.42,4.47 270 top
C7  73.55,30.4 90 top
C8  45.47,6.86 90 top
C9  19.05,3.81 270 top
C10  19.05,10.16 270 top
C11  47.24,30.99 270 bottom
C12  58.01,11.68 180 bottom
C13  49.53,30.99 270 bottom
C14  76.7,26.8 180 top
C15  37.75,20.45 180 top
C16  83.36,8.19 270 top
C17  83.31,13.72 270 top
C18  41.35,23.55 270 top
C19  84.01,25.29 270 top
C20  87.65,19.95 180 top
C21  87.56,30.66 180 top
C22  58.01,9.59 180 bottom
C23  63.65,17.33 180 top
C24  61.98,21.59 270 top
C25  64.52,21.59 270 top
C26  53.85,29.46 0 top
C27  53.85,31.75 0 top
C28  41.98,30.93 90 bottom
C29  44.45,30.93 90 bottom
C30  62.3,30.4 90 top
C31  65.4,26.85 180 top
C32  79.75,30.3 270 top
C33  58.66,4.3 90 top
C34  37.8,26.7 0 top
C35  68.6,30.4 270 top
C36  35.3,20.7 0 bottom
CON1  4.53,42.66 90 top
D1  27.94,64.77 180 top
D2  12.95,55.88 0 top
D3  22.1,56.64 270 top
D6  23.5,3.17 90 top
D7  23.5,7.62 270 top
D8  81.03,54.86 180 top
D9  68.83,38.61 180 top
D10  68.83,54.86 180 top
D11  81.03,38.61 180 top
IC1  49.02,43.56 90 top
IC2  43.56,64.47 0 top
JP1  29.21,43.43 180 top
JP2  11.78,24.07 0 top
K1  81.03,61.72 90 top
K2  68.83,45.47 90 top
K3  68.83,61.72 90 top
K4  81.03,45.47 90 top
LED1  27.94,59.69 90 top
Q1  34.14,36.84 270 top
R1  27.94,57.15 0 top
R2  13.34,41.91 0 top
R3  13.34,44.45 0 top
R4  11.68,49.53 90 top
R5  24.89,49.53 90 top
R6  15.88,3.81 270 top
R7  15.88,10.16 270 top
R8  27.3,3.17 270 top
R9  30.48,3.17 90 top
R10  27.3,7.62 90 top
R11  30.48,7.62 270 top
R12  95.87,26.96 0 top
R13  95.85,21.65 0 top
R14  21.59,35.31 0 top
R20  35.5,12.8 0 bottom
SJ1  37,47.54 180 top
SJ2  37,50.65 180 top
SJ3  36.9,53.75 180 top
SPI  22.1,27.69 180 bottom
TP1  54.61,60.07 0 top
TP2  74.12,13.85 0 top
TP3  74.17,9.32 0 top
TP4  81.12,9.16 0 top
TP5  81.17,12.75 0 top
TP8  11.43,37.47 0 top
TP9  15.88,37.47 0 top
U1  21.21,44.45 0 top
U2  13.34,33.66 0 top
U3  18.29,49.53 0 top
U5  38.25,36.82 90 bottom
U8  76.96,8.64 0 top
U9  76.96,13.21 0 top
U10  35.56,3.81 0 top
U11  35.56,7.62 0 top
U13  87.67,25.08 270 top
U14  59.31,36.96 0 top
U15  59.31,41.4 0 top
U16  59.31,50.29 0 top
U17  59.31,45.85 0 top
U$1  46.23,11.43 0 top
U$2  63.26,12.83 270 top
U$3  45.47,2.79 90 top
U$4  50.02,10.98 90 top
U$5  54.2,11.41 180 top
U$6  51.24,20.26 90 top
U$7  62.06,4.45 0 top
U$8  37.75,23.6 270 top
U$9  65.4,30.45 180 top
U$10  76.65,30.4 180 top
U$11  5.05,12.25 0 top
U$12  94.9,12.25 180 top
U$13  36.03,16.66 90 bottom
X2  16.7,67.44 180 top
X5  95,52.32 90 top
X6  51.9,5.35 270 top

### Tracks (layer width: path | path; a pad name or v marks a point on that pad's centre or on a via)
+1.8-MEM  (via drill 0.61 pad 1.02)
  Top 0.254: v50.61,34.27 54.22,34.27 62.72,25.77 65.27,25.77 C31.1 66.35,27.39 66.35,27.48 66.35,27.63 66.35,27.93 U$9.5 | v48.35,26.25 48.74,25.87 48.99,25.87 U$6.35
  Bottom 0.254: 50.61,31.94 50.61,28.51 v48.35,26.25 | v50.61,34.27 50.61,31.94 | 50.61,31.94 C13.1 48.32,31.94 C11.1
+1.8-VA  (via drill 0.61 pad 1.02)
  Top 0.254: U$7.5 61.11,6.58 61.01,6.68 C4.1 61.01,9.05 56.95,13.11 v56.95,13.26 55.39,13.26 53.99,14.66 U$6.12
  Bottom 0.254: v56.95,13.26 56.95,12.86 57.06,12.76 C12.1 C22.1
+1.8-VCORE  (via drill 0.61 pad 1.02)
  Top 0.254: 44.15,24.5 45.64,23.01 U$6.37 | 44.15,24.5 C18.1 40.27,24.5 40.22,24.55 U$8.5 | 44.15,24.5 44.15,24.92 v45.79,26.56
  Bottom 0.254: v45.79,26.56 45.79,30.54 C29.2 43.06,31.88 C28.2
+3V3  (via drill 0.61 pad 1.02)
  Top 0.254: 14.78,44.45 15.27,44.45 17.68,44.45 | R3.2 14.78,44.45 | 14.78,41.91 15.27,41.91 17.29,39.89 17.29,35.58 15.62,33.91 U2.7 | R2.2 14.78,41.91 | 14.78,44.45 14.78,41.91 | 17.68,44.45 18.65,43.48 18.95,43.48 U1.4 | 19.41,46.44 18.56,46.44 17.68,45.57 17.68,44.45 | 19.41,46.44 20.35,46.44 21.49,45.3 | 19.41,46.44 19.41,49.29 19.64,49.52 21.93,49.52 22.07,49.66 22.07,51.44 U3.8 | 41.65,47.23 41.34,47.54 SJ1.1 | 41.65,47.23 42.29,46.59 v42.29,36.13 47.21,31.21 52.9,31.21 | 41.65,47.23 43.06,48.64 IC1.18 45.42,48.64 45.42,52.94 44.61,53.75 SJ3.1 38.42,54.88 34.02,54.88 24.55,45.41 U1.8 21.66,45.41 21.6,45.41 21.49,45.3 | v42.17,50.88 39.68,50.88 39.44,50.65 SJ2.1 | 52.9,31.21 52.9,30.67 C26.1 57.05,25.31 76.16,25.31 C14.1 | C27.1 52.9,31.21 | 35.61,5.69 35.61,4.47 U10.5 | 36.14,8.28 35.61,7.75 35.61,5.69 | 35.61,5.69 27.3,5.69 | 87,20.73 87,21.08 87.01,21.09 U13.10 | 84.77,20.66 | 84.77,20.66 86.31,20.66 86.38,20.73 87,20.73 | C20.2 87,20.73 | 84.77,20.66 78.63,26.8 C14.1 | 78.84,13.87 84.34,19.37 84.34,20.23 84.77,20.66 | 21.49,45.3 21.49,44.12 21.98,44.12 | 27.3,5.69 27.3,5.11 R8.1 | v36.14,9.17 36.14,8.28 | U11.5 36.14,8.28 | v40.92,26.95 41.36,27.4 48.45,27.4 49.49,26.36 49.49,25.87 U$6.34 | R10.1 27.3,5.69 | IC1.9 52.62,46.1 52.59,46.07 v52.23,46.07 | 21.98,44.12 22.48,43.62 U1.5 | U1.6 21.98,44.12 | 78.84,13.87 78.84,13.55 78.5,13.21 77.36,13.21 77.01,12.87 77.01,9.3 U8.5 | U9.5 78.84,13.87 | U$10.5 77.6,28.28 77.65,28.23 C14.1
  Bottom 0.254: v42.17,50.88 51.87,50.88 52.4,50.35 52.4,46.25 v52.23,46.07 v42.29,36.13 42.14,35.98 40.86,35.98 | 40.86,35.98 38.88,37.96 U5.7 | 40.83,33.02 40.83,35.96 40.86,35.98 | 36.25,18.4 37.2,17.45 37.2,16.15 37.32,16.03 38.32,16.03 | v36.14,9.17 36.45,9.48 R20.1 36.45,13.93 37.2,14.69 37.2,14.76 U$13.8 38.63,15.72 38.32,16.03 | U$13.7 38.32,16.03 | 36.25,18.4 34.27,18.4 33.16,17.3 U$13.3 | 36.25,18.4 36.25,19.62 C36.1 36.25,22.29 v40.92,26.95 40.83,27.04 40.83,33.02 | 40.83,33.02 37.2,33.02 36.96,33.26 36.96,35.48 36.77,35.68 35.94,35.68 35.63,35.38 35.63,31.56 29.81,25.73 SPI.14
+5V  (via drill 0.61 pad 1.02)
  Top 0.762: 26.73,25.34 33.8,25.34 34.81,24.34 | 26.73,25.34 13.79,25.34 JP2.2 | v42.18,33.94 31.43,33.94 26.73,29.25 26.73,25.34 | 34.81,24.34 34.81,15.04 39.7,10.15 39.7,5.75 44.65,0.81 56.42,0.81 58.96,3.35 | 34.81,24.34 35.03,24.55 35.38,24.55 35.92,24.55 | v66.31,34.15 66.35,34.11 U$9.1 68.6,31.74 | 68.6,31.74 68.6,32.59 68.78,32.77 77.6,32.77 U$10.1 77.98,31.69 78.42,31.25 C32.1 | C35.1 68.6,31.74 | 58.96,3.35 59.27,3.35 60,3.35 60.18,3.16 U$7.1 | C33.1 58.96,3.35 | C34.1 36.85,25.37 36.74,25.37 35.92,24.55 | U$8.1 35.92,24.55 | 48.91,62.63 48.91,66.04 C3.1 | 48.91,62.63 48.21,61.93 IC2.3 | TP1.TP 51.47,60.07 48.91,62.63
  Bottom 0.762: 54.61,44.98 43.58,33.94 v42.18,33.94 | 54.61,44.98 55.48,44.98 v66.31,34.15 | 54.61,44.98 54.61,58.41 TP1.TP
CE0
  Bottom 0.254: CON1.24 4.3,55.36 5.34,56.4 6.24,56.4 9.87,52.77 9.87,36.59 18.11,28.35 SPI.5
GND  (via drill 0.61 pad 1.02)  (1 unrouted)
  Top 0.254: 20.98,42.75 20.98,44.73 20.93,44.78 U1.2 | 20.64,37.59 20.64,36.44 R14.1 | 20.64,37.59 20.64,42.41 20.98,42.75 | 20.98,42.75 26.39,42.75 28.06,41.07 30.31,41.07 30.96,41.73 30.96,44.7 | 56.31,5.25 56.31,4.68 X6.3 X6.4 45.93,2.81 45.47,2.35 | 24.23,9.55 24.23,7.83 24.04,7.65 23.5,7.65 D7.P$1 23.5,4.61 D6.P$1 | 24.23,9.55 24.23,12.51 24.13,12.61 B1.- | 24.23,9.55 28.25,9.55 29.35,8.45 29.35,6.67 R11.2 31.05,6.67 31.61,6.67 33.39,6.67 33.68,6.96 U11.3 | 88.33,29.71 U13.3 88.33,26.93 88.13,26.73 88.13,26 87.67,25.54 U13.11 87.67,21.09 87.94,21.09 88.3,20.73 C20.1 | 77.33,30.18 76.67,29.52 76.67,28.69 75.86,27.89 75.75,27.89 C14.2 | 77.33,30.18 77.84,30.18 78.67,29.35 C32.2 81.84,31.45 87.43,31.45 C21.1 88.21,29.88 88.33,29.77 88.33,29.71 | 77.33,30.18 | 77.33,30.18 76.65,30.87 U$10.2 U$10.3 75.03,31.69 74.69,31.35 C7.2 70.5,31.35 C35.2 67.52,29.45 66.87,30.11 65.92,30.11 | v62.52,27.32 63.01,27.32 63.47,26.85 C31.2 64.45,27.93 64.62,27.93 65.12,28.44 65.12,29.31 65.92,30.11 | 44.35,13.38 50.14,13.38 50.99,14.23 U$6.6 | 36.8,20.99 35.52,19.71 35.52,15.45 37.59,13.38 44.35,13.38 | 45.47,2.35 45.23,2.35 44.35,3.23 44.35,13.38 | U$3.1 45.47,2.35 | 36.8,20.99 36.8,21.53 36.46,21.87 U$8.3 36.46,22.93 U$8.2 37.28,23.6 38.19,23.6 | C15.2 36.8,20.99 | 88.33,29.71 94.54,29.71 R12.2 | 58.29,44.53 59.28,43.53 59.28,41.99 58.29,41 U15.2 58.29,39.78 59.28,38.78 59.28,37.54 58.29,36.55 U14.2 58.29,35.64 58.29,35.33 61.29,32.34 62.3,32.34 C30.2 63.38,31.35 63.77,31.74 U$9.3 65.12,31.74 65.12,31.61 65.4,31.33 | 56.69,47.37 56.69,46.13 58.29,44.53 | U10.3 33.68,3.15 32.7,4.12 v32.26,4.12 31.61,4.12 R9.2
  Top 0.254: U$6.6 U$6.7 U$6.8 U$6.9 | U$12.GND 93.45,12.3 93.45,11.84 91,9.39 88.36,9.39 85.21,6.24 77.73,6.24 U8.3 75.08,7.98 70.5,7.98 66.09,12.38 | 56.31,5.25 54.44,7.12 X6.2 50.02,7.89 | 56.31,5.25 C33.2 59.74,5.25 60.51,4.47 61.38,4.47 | SJ3.3 35.38,51.88 35.48,51.78 SJ2.3 SJ1.3 34.56,47.54 31.73,44.7 30.96,44.7 | 66.09,12.38 66.09,16.82 65.58,17.33 C23.1 | 61.38,4.47 61.99,5.08 61.99,6.09 62.79,6.89 62.91,6.89 C4.2 62.91,9.05 63.43,9.57 63.43,12.38 64.09,12.38 | 61.38,4.47 61.38,4.25 62.06,3.57 62.06,3.37 | 56.69,47.37 IC1.10 | 56.69,47.37 58.29,48.97 U16.2 | U17.2 58.29,44.53 | 7.32,35.02 8.42,33.91 U2.2 | 65.92,30.11 65.92,30.81 65.4,31.33 | U9.3 74.2,12.55 66.28,20.46 v66.28,20.77 C25.1 63.06,22.54 C24.1 | U$9.2 65.4,31.33 | X6.5 50.02,7.89 | 50.02,7.89 50.02,9.3 U$4.1 | 64.09,12.38 61.99,14.48 U$2.1 | 64.09,12.38 U$2.3 66.09,12.38 | U$6.6 U$6.5 | 62.06,3.37 62.13,3.37 62.34,3.16 U$7.3 63.98,3.16 64.34,3.52 C6.2 | U$7.2 62.06,3.37 | 16.32,56.16 15.99,55.83 D2.AN | 16.32,56.16 16.32,60.9 15.2,62.02 X2.P$1 | 22.05,55 17.49,55 16.32,56.16 | 22.05,55 22.05,55.46 25.34,58.76 26.89,58.76 26.89,59.62 LED1.C 26.89,60.62 27.14,60.88 27.14,64.54 29.9,67.3 40.22,67.3 40.91,66.61 40.91,66.04 C2.2 42.6,66.04 43.56,66.04 | D3.AN 22.05,55 | 4.3,46.69 4.3,48.2 3.26,49.24 CON1.20 3.26,51.32 4.75,52.82 4.75,55.81 5.8,56.86 CON1.25 | 4.3,46.69 4.3,44.74 3.26,43.7 CON1.14 | 4.3,46.69 13.56,46.69 14.5,47.62 U3.4 | 7.32,35.02 6.07,33.77 5.57,33.77 4.3,32.5 CON1.6 | 7.32,35.02 5.8,36.54 CON1.9 | JP1.1 30.96,44.7 | 46.36,21.51 45.64,21.51 45.64,21.75 45.9,22.01 | U$6.40 46.36,21.51 | 46.36,21.01 45.64,21.01 45.64,20.51 U$6.42
  Top 0.254: U$6.41 46.36,21.01 | 46.36,21.01 46.36,21.51 | 45.9,22.01 46.84,22.01 U$6.39 | 43.56,66.04 C3.2 | 43.56,66.04 43.56,63.02 IC2.2 | 38.19,23.6 38.19,25.06 38.75,25.62 C34.2 | 38.19,23.6 39.46,23.6 40.27,22.79 40.27,22.6 C18.2 41.89,22.6 42.43,22.6 43.02,22.01 45.64,22.01 45.9,22.01 | 20.64,37.59 24.89,37.59 24.89,32.51 19.3,29.72
  Bottom 0.254: IC2.2 43.56,59.32 42.78,59.32 29.21,45.74 JP1.1 | v62.52,27.32 62.52,24.53 v66.28,20.77 66.28,14.99 59.18,7.89 X6.2 | 26.5,14.21 25.73,14.21 B1.- 22.53,14.21 20.1,16.64 12.64,16.64 | 32.26,8.46 26.5,14.21 | 26.5,14.21 30.3,18.01 30.3,18.57 U$13.4 32.45,18.57 33.16,18.57 33.16,20.5 33.37,20.7 C36.2 34.35,21.78 36.34,23.77 U5.4 | X6.5 36.2,7.89 35.63,8.46 32.26,8.46 | 32.26,8.46 v32.26,4.12 | 12.64,16.64 11.57,15.56 9.4,15.56 6.5,12.65 6.5,12.2 U$11.GND | 12.64,16.64 12.64,17.86 4.3,26.2 4.3,30.41 3.26,31.46 CON1.6 | CON1.25 6.84,57.9 12.06,63.12 X2.P$1 | CON1.9 5.8,38.62 4.3,40.12 4.3,40.58 3.26,41.62 CON1.14
  other vias: 32.77,57.4 40.64,56.64 48.51,56.64 33.27,67.31 36.07,67.31 33.27,63.25 36.07,63.25 58.93,61.21 61.72,61.21 61.47,56.64 58.67,56.64 43.94,65.53 45.47,65.53 29.72,37.59 34.04,42.16
  pour Top: 0,70.1 99.82,70.1 99.82,0 0,0
  pour Bottom: 0.25,70.1 99.82,70.1 99.82,0 0.25,0 0,70.1
MISO
  Bottom 0.254: 8.12,49.45 8.12,37.02 18.11,27.03 SPI.3 | 8.12,49.45 | 8.12,49.45 5.8,51.78 CON1.21
MOSI
  Bottom 0.254: CON1.19 5.8,49.24 7.29,47.74 7.29,37.19 18.1,26.39 SPI.2
N$1
  Top 0.254: D1.A 24.68,64.77 23.03,63.12 X2.P$2
N$2
  Top 0.254: U$2.2 60.43,12.38 56.85,15.96 56.85,18.51 U$6.15
N$3
  Top 0.254: CON1.3 10.96,29.96 13.89,32.89 U2.5
N$4
  Top 0.762: JP2.1 7.87,22.8 CON1.2
  Bottom 0.762: CON1.4 CON1.2
N$5
  Top 0.254: K1.4 85.96,65.53 90.68,60.81 X5.P$1
N$6
  Top 0.254: CON1.5 6.84,32.5 7.23,32.89 U2.4
N$7
  Top 0.254: IC1.21 45.42,44.83 45.42,46.37 52.62,53.57 57.46,53.57 59.28,51.75 59.28,48.46 58.29,47.47 U17.1
N$8
  Top 0.254: U2.3 U2.6 15.62,33.4 | 15.62,33.4 21.77,33.4 22.54,34.18 R14.2 | CON1.1 10.42,27.42 15.62,32.62 15.62,33.4
  Bottom 0.254: CON1.1 16.42,27.42 18.11,25.73 18.64,25.73 SPI.1 20.24,25.73 23.95,29.44 23.95,29.64 SPI.8
N$9
  Top 0.254: 76.76,41.66 77.22,41.2 D11.A | 76.76,41.66 76.1,41.66 75.27,42.49 63.08,42.49 60.33,45.24 U17.3 | K4.8 76.76,41.66
N$10
  Top 0.254: IC1.17 43.06,49.91 41.82,48.67 37,48.67 SJ1.2
N$11
  Top 0.254: IC1.16 43.06,51.18 42.47,51.78 37,51.78 SJ2.2
N$12
  Top 0.254: K4.4 85.96,49.28 87.5,50.82 X5.P$7
N$13
  Top 0.254: K4.3 85.96,46.74 87.04,47.82 X5.P$8
N$14
  Top 0.254: LED1.A 28.06,59.69 28.06,59.13 27.21,58.28 26.99,58.28 R1.1
N$15
  Bottom 0.254: Q1.2 35.19,36.62 37.94,36.62 38.88,35.68 U5.2
N$16  (via drill 0.61 pad 1.02)
  Top 0.254: v26.69,38.27 25.47,39.48 25.38,39.48 B1.+
  Bottom 0.254: v26.69,38.27 30.41,34.55 34.53,34.55 35.18,35.2 35.18,35.62 35.72,36.16 37.13,36.16 37.61,35.68 U5.3
N$17
  Bottom 0.254: U5.1 40.15,35.68 38.7,37.13 35.12,37.13 Q1.1
N$18
  Top 0.254: IC1.24 45.42,41.02 51.66,34.79 55.72,34.79 58.29,37.36 U14.1
N$19
  Top 0.254: IC1.23 45.42,42.29 52.45,35.26 55.13,35.26 56.8,36.92 56.8,40.31 58.29,41.81 U15.1
N$20
  Top 0.254: K1.3 83.3,62.99 83.3,59.74 83.61,59.43 86.63,59.43 88.83,57.23 88.83,55.67 X5.P$2
N$21
  Top 0.254: IC1.22 45.42,43.56 45.42,44.18 47.12,45.88 47.12,47.42 52.81,53.11 57.1,53.11 58.29,51.92 U16.1
N$22
  Top 0.254: U14.3 77.65,36.96 78.88,38.18 78.88,42.2 77.71,43.37 76.29,43.37 74.63,45.03 72.17,45.03 71.1,46.1 71.1,50 75.97,54.86 76.39,54.86 | K1.8 76.1,57.91 76.1,61.38 73.62,63.85 71.27,63.85 71.1,63.68 71.1,59.81 71.3,59.62 72.69,59.62 76.39,55.92 76.39,54.86 | D8.A 76.39,54.86
N$23
  Top 0.254: U15.3 63.65,41.4 63.9,41.66 64.57,41.66 | 64.57,41.66 65.02,41.2 D9.A | K2.8 64.57,41.66
N$24
  Top 0.254: U16.3 61.32,50.29 64.9,53.87 65.02,53.87 D10.A 65.02,55.85 63.9,56.98 63.9,57.91 K3.8
N$26
  Top 0.254: U$6.16 57.24,19.01 60.26,16 62.21,16 63.43,14.78 63.43,14.48 U$2.4
N$27
  Top 0.254: U8.1 74.87,9.3 74.85,9.32 TP3.TP 74.17,10 73.87,10 64.21,19.66 | 64.21,19.66 60.7,19.66 60.35,20.01 U$6.18 | 64.21,19.66 64.21,19.84 64.52,20.15 C25.2
N$28
  Top 0.254: X6.1 47.1,5.35 46.55,5.91 C8.1 U$3.2
N$29  (via drill 0.61 pad 1.02)
  Top 0.254: v72.38,8.83 72.57,8.64 U8.2 76.91,8.64 76.91,7.76 77.2,7.47 79,7.47 80.44,8.9 80.44,9.16 TP4.TP 82.26,9.16 82.28,9.14 C16.1 | U10.2 35.51,3.81 35.51,2.91 35.82,2.6 37.7,2.6 v38.74,3.64
  Bottom 0.254: v38.74,3.64 39.29,4.19 67.74,4.19 v72.38,8.83
N$30  (via drill 0.61 pad 1.02)
  Top 0.254: v33.13,7.62 U11.2 | v79.25,10.9 80,10.9 81.17,12.07 TP5.TP 82.22,12.75 82.23,12.77 C17.2 | v77.14,14.77 77.01,14.65 77.01,13.65 76.57,13.21 U9.2
  Bottom 0.254: 77.14,13.01 v79.25,10.9 | v77.14,14.77 77.14,13.01 | 77.14,13.01 65.82,13.01 59.32,6.51 34.24,6.51 v33.13,7.62
N$31  (via drill 0.61 pad 1.02)
  Top 0.254: 37.44,6.96 38.34,7.86 v38.34,8.78 | 37.44,6.96 37.44,3.15 U10.4 | IC1.3 52.62,38.48 52.58,38.43 v52.14,38.43 | U11.4 37.44,6.96
  Bottom 0.254: v38.34,8.78 43.22,13.66 43.22,17.47 52.14,26.39 v52.14,38.43
N$32
  Top 0.254: U$5.1 55.05,12.39 53.49,13.95 U$6.11
N$33  (via drill 0.61 pad 1.02)
  Top 0.254: v18.55,45.24 18.73,45.41 18.95,45.41 U1.1 | IC1.5 49.33,41.02 v46.39,43.96
  Bottom 0.254: v46.39,43.96 46.06,43.64 20.16,43.64 v18.55,45.24
N$34
  Top 0.254: 74.46,13.85 74.46,14.53 65.47,23.52 61.02,23.52 60.9,23.4 60.9,20.64 | 74.46,13.85 74.8,13.85 74.82,13.87 U9.1 | TP2.TP 74.46,13.85 | C24.2 60.9,20.64 | U$6.19 60.77,20.51 60.9,20.64
N$35  (via drill 0.61 pad 1.02)
  Top 0.254: v55.46,38.07 55.46,39.27 54.98,39.75 IC1.4 | v49.78,14.26 49.78,14.45 49.99,14.66 U$6.4
  Bottom 0.254: v55.46,38.07 54.67,37.28 54.67,36.43 54.91,36.19 54.91,18.72 50.45,14.26 v49.78,14.26
N$36
  Top 0.254: 22.72,8.42 20.92,8.42 20.13,9.21 | D7.P$2 22.72,8.42 | 22.72,8.42 22.72,3.33 22.91,3.15 24.03,3.15 26.18,5.29 26.18,8.57 R10.2 | 20.13,9.21 20.13,12.53 23.42,15.82 24.79,15.82 30.48,10.13 R11.1 33.39,8.57 33.68,8.28 U11.1 | C10.2 20.13,9.21
N$37
  Top 0.254: 29.35,2.23 29.35,5 29.46,5.11 33.05,5.11 33.68,4.47 U10.1 | 29.35,2.23 R8.2 24.38,2.23 24.23,2.38 D6.P$2 20.61,2.38 20.13,2.86 C9.2 | R9.1 29.35,2.23
N$38  (via drill 0.61 pad 1.02)
  Top 0.254: v87.16,26.52 87.57,26.93 87.67,26.93 U13.4 | IC1.1 52.62,35.94 50.75,37.82 v50.75,38.16
  Bottom 0.254: v87.16,26.52 72.49,26.52 59.74,39.27 51.79,39.27 50.75,38.23 v50.75,38.16
N$39
  Top 0.254: C6.1 64.34,5.42 64.01,5.75 U$7.4
N$40  (via drill 0.61 pad 1.02)
  Top 0.254: U13.2 v88.97,26.37
  Bottom 0.254: v88.97,26.37 87.13,24.54 87.13,11.11 89.54,8.7 89.9,8.7 U$12.LEFT
N$41
  Top 0.254: IC1.15 43.06,52.45 42.89,52.62 36.9,52.62 SJ3.2
N$44  (via drill 0.61 pad 1.02)
  Top 0.254: v89.09,23.61 89.09,23.35 88.97,23.23 U13.13 | v89.09,23.61
  Bottom 0.254: U$12.RIGHT 89.9,22.8 v89.09,23.61
N$45
  Top 0.254: R12.1 95.7,24.21 95.7,23.72 96.63,22.78 96.8,22.78 R13.2
N$46
  Top 0.254: R13.1 93.92,21.65 91.11,24.46 88.74,24.46 88.22,23.94 88.22,22.27 U13.12
N$47
  Top 0.254: R6.2 14.74,2.86 14.74,11.46 10.41,15.79 10.05,15.79 U$11.LEFT
N$48
  Top 0.254: R6.1 C9.1
N$49  (via drill 0.61 pad 1.02)
  Top 0.254: v16.2,7.81 16.2,7.9 15.88,8.23 R7.2
  Bottom 0.254: U$11.RIGHT 15.64,7.25 v16.2,7.81
N$50
  Top 0.254: R7.1 C10.1
N$51
  Top 0.254: JP1.2 29.21,43.21 28.17,43.21 26.59,44.78 U1.7
N$52
  Top 0.254: K2.4 73.76,49.28 76.45,51.96 89.54,51.96 X5.P$3
N$53
  Top 0.254: U13.1 89.63,26.93 96.06,26.93 98,24.99 98,20.87 97.39,20.27 92.51,20.27 90.96,18.71 88.14,18.71 84.44,15.01 84.44,8.32 C16.2
N$54
  Top 0.254: C19.2 84.01,23.96 84.75,23.23 86.38,23.23 U13.9
N$55
  Top 0.254: C17.1 83.31,15.65 86.83,19.17 88.81,19.17 89.63,19.98 U13.14
N$56
  Top 0.254: C19.1 84.01,26.62 84.32,26.93 86.38,26.93 U13.6
N$57
  Top 0.254: C21.2 86.91,29.88 87.01,29.79 U13.5
N$58
  Top 0.254: C15.1 38.7,21.53 39.05,21.88 U$8.4
N$59
  Top 0.254: 52.72,11.63 52.72,12.23 52.99,12.51 U$6.10 | 52.72,11.63 52.72,11.41 U$5.2 | 52.72,11.63 51,11.63 U$4.2 47.91,11.63 47.71,11.43 U$1.2
N$60
  Top 0.254: K2.3 73.76,46.74 74.59,47.57 85.7,47.57 87.09,48.96 89.54,48.96 X5.P$4
N$61
  Top 0.254: C8.2 45.47,8.79 45.38,8.88 U$1.1
N$62
  Top 0.254: C30.1 63.38,29.45 63.68,29.15 U$9.4
N$63
  Top 0.254: K3.4 73.76,65.53 73.76,64.65 76.39,62.02 80.06,62.02 83.22,58.86 85.73,58.86 87.68,56.91 X5.P$5
N$64
  Top 0.254: K3.3 73.76,62.99 73.76,59.58 76.37,56.98 78.52,56.98 81.67,53.82 X5.P$6
N$65
  Top 0.254: C7.1 74.63,29.45 74.98,29.1 U$10.4
N$66  (via drill 0.61 pad 1.02)
  Top 0.254: v55.53,36.85 55.34,36.85 54.98,37.21 IC1.2 | 78.84,12.36 78.84,11.67 78.42,11.24 78.42,10.55 78.84,10.12 78.84,7.98 U8.4 | v79.67,12.36 78.84,12.36 | 78.84,12.36 78.84,12.55 U9.4
  Bottom 0.254: v79.67,12.36 79.67,13.44 56.25,36.85 v55.53,36.85
N$68  (via drill 0.61 pad 1.02)
  Top 0.254: U$6.13 55.88,17.03 v55.88,16.19
  Bottom 0.254: v55.88,16.19 58.96,13.11 C12.2 C22.2
N$69
  Top 0.254: C23.2 61.72,17.33 59.53,19.51 U$6.17
N$70  (via drill 0.61 pad 1.02)
  Top 0.254: v46.84,33.48 46.95,33.38 53.17,33.38 C27.2 C26.2 | U$6.36 47.19,25.71 v46.95,25.71
  Bottom 0.254: v46.84,33.48 46.15,32.79 46.15,31.17 47.28,30.04 47.31,30.04 | 47.31,30.04 C11.2 47.24,29.06 46.95,28.77 v46.95,25.71 45.43,25.71 44.45,26.69 C29.1 C28.1 | C13.2 47.31,30.04
NVMISO  (via drill 0.61 pad 1.02)
  Top 0.254: v36.36,17.07 37.31,18.01 U$6.47
  Bottom 0.254: U$13.2 35.33,16.03 v36.36,17.07
NVMOSI  (via drill 0.61 pad 1.02)
  Top 0.254: U$6.48 45.64,17.51 45.11,16.99 v41.23,16.99
  Bottom 0.254: U$13.5 40.06,18.57 40.06,18.15 v41.23,16.99
NVSCLK  (via drill 0.61 pad 1.02)
  Top 0.254: v42.38,14.66 48.99,14.66 U$6.2
  Bottom 0.254: v42.38,14.66 40.06,16.97 40.06,17.3 U$13.6
NVSSB  (via drill 0.61 pad 1.02)
  Top 0.254: v36.64,15.52 47.9,15.52 U$6.1
  Bottom 0.254: 34.55,13.93 | 34.55,13.93 35.05,13.93 v36.64,15.52 | 34.55,13.93 33.99,13.93 33.16,14.76 U$13.1 | R20.2 34.55,13.93
SCL  (via drill 0.61 pad 1.02)
  Top 0.254: v50.69,48.71 51.51,48.71 52.62,49.83 52.62,49.91 IC1.12 | U2.1 11.05,34.42 11.05,35.67 11.43,36.05 TP8.TP | U3.7 19.43,50.16 18.65,49.38 18.65,48 v16.22,45.57 16.21,45.58 12.38,45.58 R3.1
  Bottom 0.254: 37.61,40.6 38.8,41.79 45.46,41.79 50.69,47.01 v50.69,48.71 | 37.61,40.6 28.53,40.6 26.36,42.78 18.15,42.78 | v16.22,45.57 16.22,44.72 18.15,42.78 | 18.15,42.78 12.84,37.47 TP8.TP | U5.6 37.61,40.6
SCL_LONG  (via drill 0.61 pad 1.02)
  Top 0.254: U3.5 22.07,47.62 22.07,48.23 21.41,48.9 | 21.41,48.9 22.07,48.9 22.18,49 v22.83,49 23.34,49 23.76,48.58 R5.1 | U3.6 21.41,48.9 | D3.KAT 22.05,59.78 21.71,60.12 X2.P$4
  Bottom 0.254: X2.P$4 22.83,55.49 v22.83,49
SCLK
  Bottom 0.254: CON1.23 5.8,54.32 9.41,50.7 9.41,36.39 18.11,27.69 SPI.4
SDA  (via drill 0.61 pad 1.02)
  Top 0.254: IC1.13 52.62,51.18 52.62,51.01 v51.56,49.95 | U3.1 17.14,51.44 17.14,47.15 16.92,46.92 16.14,46.92 15.26,46.04 12.03,46.04 11.4,45.41 11.4,41.91 R2.1 12.38,40.78 13.97,40.78 15.88,38.88 TP9.TP 15.88,36.05 14.76,34.94 U2.8
  Bottom 0.254: v51.56,49.95 51.56,47.16 45.03,40.63 38.44,40.63 38.28,40.48 38.28,38.22 38.02,37.96 36.46,37.96 36.34,38.08 | 36.34,38.08 35.3,39.12 18.94,39.12 17.29,37.47 TP9.TP | U5.5 36.34,38.08
SDA_LONG
  Top 0.254: X2.P$3 11.67,56.59 11.67,55.83 D2.KAT 10.74,54.74 10.55,54.55 10.55,48.58 R4.1 12.25,48.58 12.81,48.58 14.19,48.58 14.5,48.9 15.28,48.9 | U3.2 14.5,50.16 14.5,49.67 15.28,48.9 | U3.3 15.28,48.9
SI-MISO  (via drill 0.61 pad 1.02)
  Top 0.254: v27.85,27.34 34.9,27.34 35.42,27.86 48.64,27.86 50.49,26.01 50.49,25.87 U$6.32
  Bottom 0.254: SPI.12 27.54,27.03 v27.85,27.34
SI_MOSI  (via drill 0.61 pad 1.02)
  Top 0.254: v30.98,28.18 31.17,28.37 48.87,28.37 50.05,27.19 | 50.05,27.19 50.99,26.24 U$6.31 | 50.05,27.19 49.96,27.18
  Bottom 0.254: SPI.13 29.2,26.39 v30.98,28.18
SI_SCLK  (via drill 0.61 pad 1.02)
  Top 0.254: U$6.30 51.49,26.39 48.86,29.02 29.84,29.02 v29.55,28.73
  Bottom 0.254: v29.55,28.73 27.12,28.73 26.09,27.69 SPI.11
SI_SSB  (via drill 0.61 pad 1.02)
  Top 0.254: v28.61,29.57 49,29.57 51.99,26.57 U$6.29
  Bottom 0.254: SPI.10 26.09,28.35 27.31,29.57 v28.61,29.57 | v28.61,29.57
VCC
  Top 0.762: R4.2 11.68,51.71 12.29,52.32 24.29,52.32 24.89,51.71 | R5.2 24.89,51.71 | 24.89,51.71 28.89,55.71 R1.2 30.12,57.15 30.19,57.22 30.19,62.76 29.96,62.99 D1.C 31.45,64.77 31.98,65.3 39.24,65.3 | D8.C 84.84,56.11 84.63,56.32 K1.1 | 40.92,61.93 40.92,59.39 41.91,58.4 58.48,58.4 59.08,59 69.77,59 70.85,57.91 K3.1 72.43,56.32 72.64,56.11 D10.C | IC2.1 40.92,61.93 | 40.92,61.93 40.41,61.93 39.67,61.93 39.67,64.12 39.24,64.56 39.24,65.3 | C2.1 39.24,65.3 | D11.C 84.84,39.85 84.63,40.06 K4.1 | K2.1 74.02,41.66 74.02,40.85 73.02,39.85 72.64,39.85 | D9.C 72.64,39.85 | 72.64,39.85
  Bottom 0.762: 72.64,53.62 72.64,39.85 | D10.C 72.64,53.62 | 72.64,53.62 84.84,53.62 D8.C | D9.C 72.64,39.85 | D11.C 84.84,39.85 72.64,39.85

### Text on the board
Top: Mainboard V2.4
tNames: 0-1 | A0 | A1 | A2